# EAGLE design MMU8L (EAGLE 6.6.0)

## Sheet 1 of 2
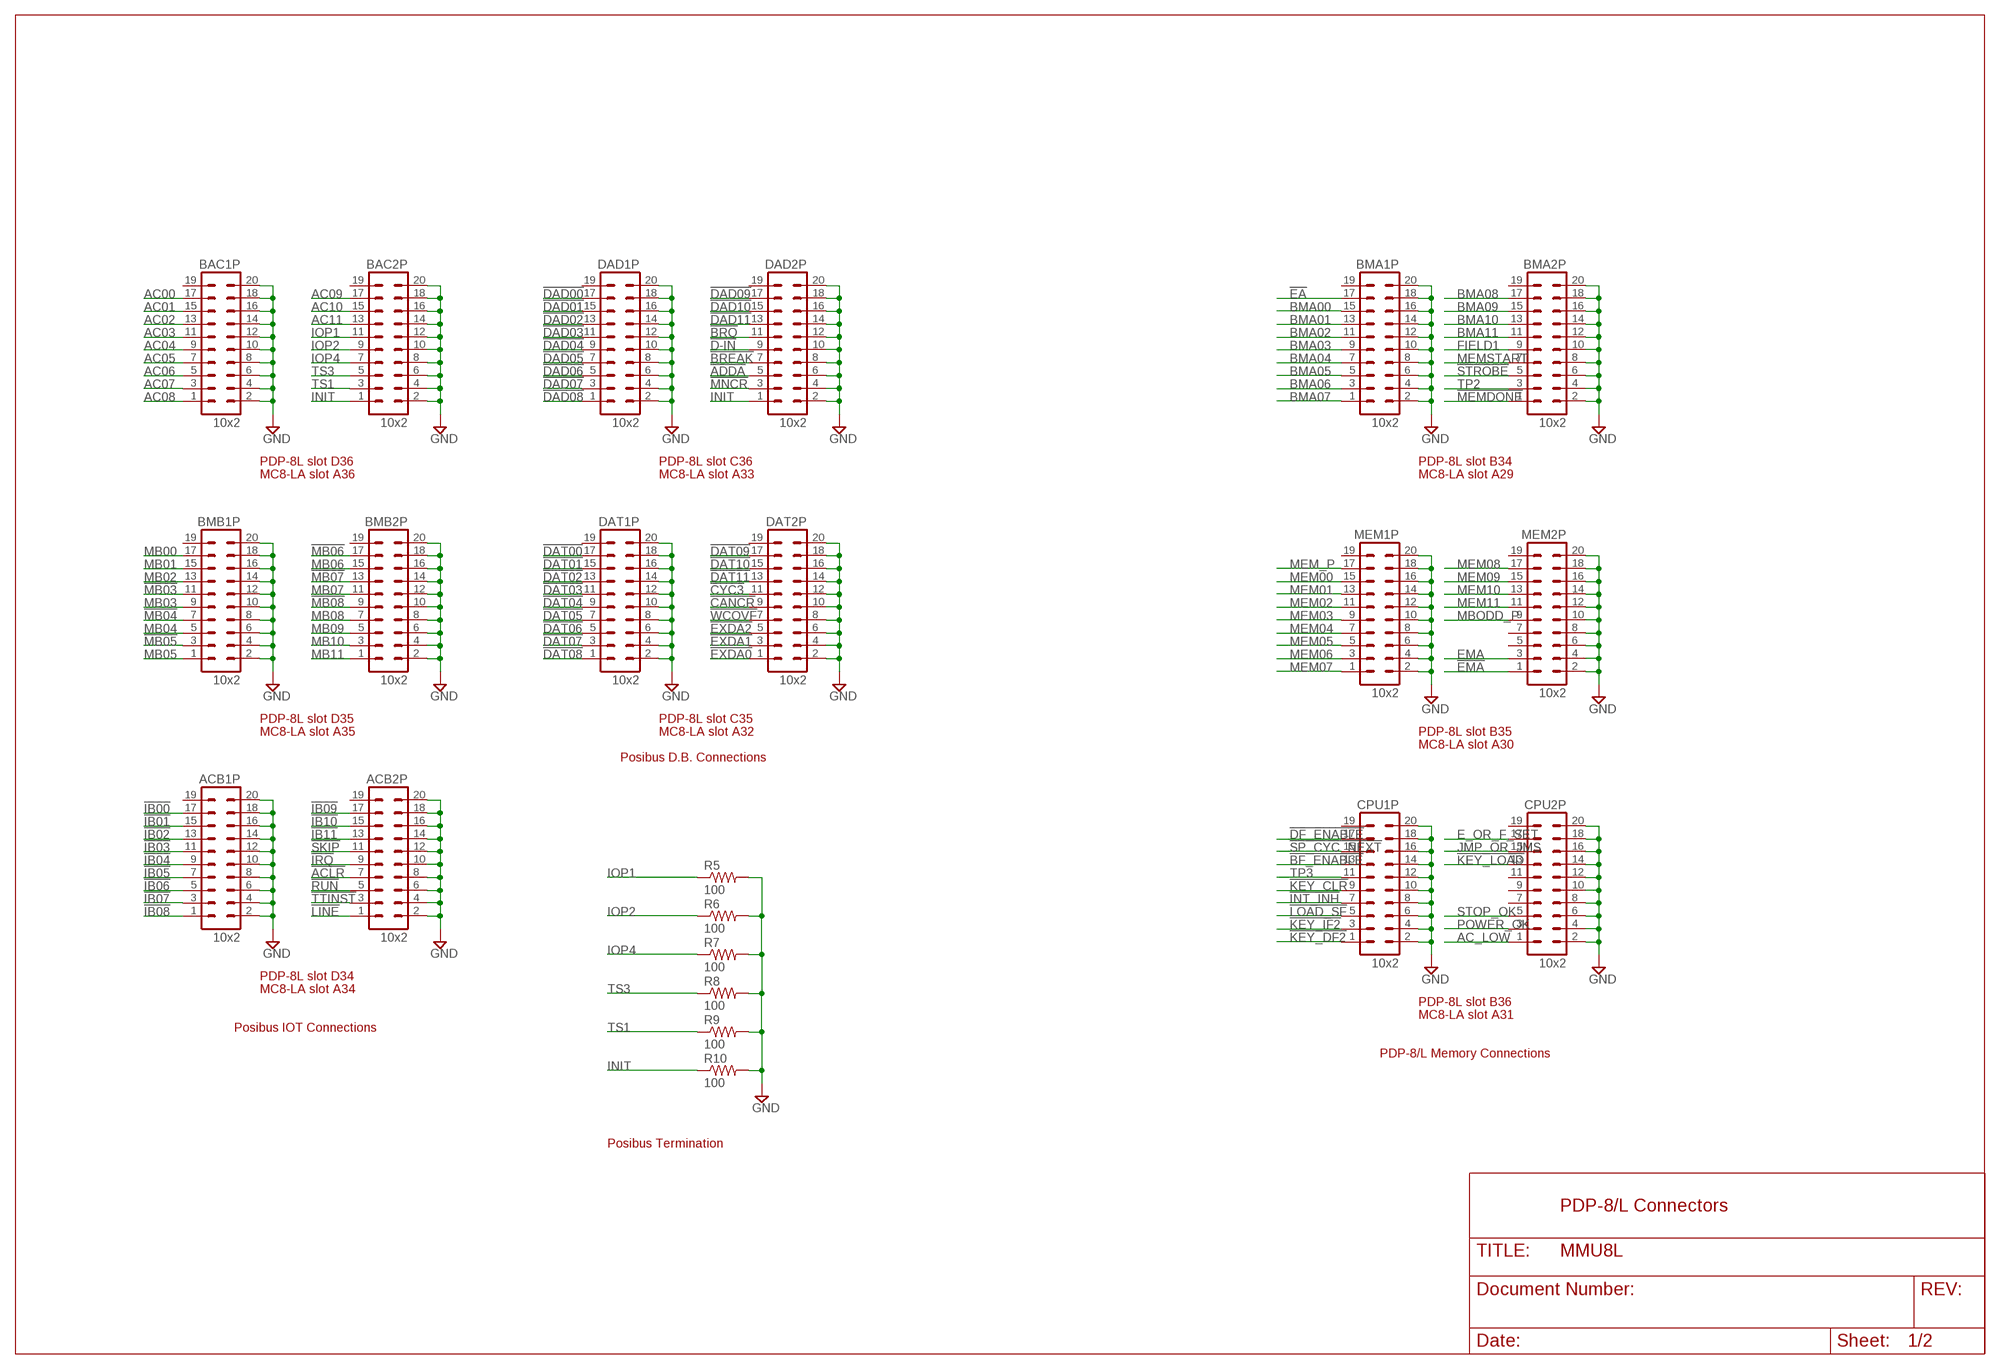
[diagram p0: schematic, sheet 1]

### Parts
ACB1P  10x2  MA10-2  [MA10-2]
ACB2P  10x2  MA10-2  [MA10-2]
BAC1P  10x2  MA10-2  [MA10-2]
BAC2P  10x2  MA10-2  [MA10-2]
BMA1P  10x2  MA10-2  [MA10-2]
BMA2P  10x2  MA10-2  [MA10-2]
BMB1P  10x2  MA10-2  [MA10-2]
BMB2P  10x2  MA10-2  [MA10-2]
CPU1P  10x2  MA10-2  [MA10-2]
CPU2P  10x2  MA10-2  [MA10-2]
DAD1P  10x2  MA10-2  [MA10-2]
DAD2P  10x2  MA10-2  [MA10-2]
DAT1P  10x2  MA10-2  [MA10-2]
DAT2P  10x2  MA10-2  [MA10-2]
MEM1P  10x2  MA10-2  [MA10-2]
MEM2P  10x2  MA10-2  [MA10-2]
R5  100  R-US_R1206  [R1206]
R6  100  R-US_R1206  [R1206]
R7  100  R-US_R1206  [R1206]
R8  100  R-US_R1206  [R1206]
R9  100  R-US_R1206  [R1206]
R10  100  R-US_R1206  [R1206]

### Nets
!ACLR: ACB2P.7 ; also sheet 2
!ADDA: DAD2P.5
!BF_ENABLE: CPU1P.13 ; also sheet 2
!BREAK: DAD2P.7
!BRQ: DAD2P.11
!CANCR: DAT2P.9
!CYC3: DAT2P.11
!D-IN: DAD2P.9
!DAD00: DAD1P.17
!DAD01: DAD1P.15
!DAD02: DAD1P.13
!DAD03: DAD1P.11
!DAD04: DAD1P.9
!DAD05: DAD1P.7
!DAD06: DAD1P.5
!DAD07: DAD1P.3
!DAD08: DAD1P.1
!DAD09: DAD2P.17
!DAD10: DAD2P.15
!DAD11: DAD2P.13
!DAT00: DAT1P.17
!DAT01: DAT1P.15
!DAT02: DAT1P.13
!DAT03: DAT1P.11
!DAT04: DAT1P.9
!DAT05: DAT1P.7
!DAT06: DAT1P.5
!DAT07: DAT1P.3
!DAT08: DAT1P.1
!DAT09: DAT2P.17
!DAT10: DAT2P.15
!DAT11: DAT2P.13
!DF_ENABLE: CPU1P.17 ; also sheet 2
!EA: BMA1P.17 ; also sheet 2
!EMA: MEM2P.1 ; also sheet 2
!EXDA0: DAT2P.1 ; also sheet 2
!EXDA1: DAT2P.3 ; also sheet 2
!EXDA2: DAT2P.5 ; also sheet 2
!IB00: ACB1P.17 ; also sheet 2
!IB01: ACB1P.15 ; also sheet 2
!IB02: ACB1P.13 ; also sheet 2
!IB03: ACB1P.11 ; also sheet 2
!IB04: ACB1P.9 ; also sheet 2
!IB05: ACB1P.7 ; also sheet 2
!IB06: ACB1P.5 ; also sheet 2
!IB07: ACB1P.3 ; also sheet 2
!IB08: ACB1P.1 ; also sheet 2
!IB09: ACB2P.17 ; also sheet 2
!IB10: ACB2P.15 ; also sheet 2
!IB11: ACB2P.13 ; also sheet 2
!INT_INH: CPU1P.7 ; also sheet 2
!IRQ: ACB2P.9 ; also sheet 2
!KEY_CLR: CPU1P.9 ; also sheet 2
!KEY_DF2: CPU1P.1 ; also sheet 2
!KEY_IF2: CPU1P.3 ; also sheet 2
!KEY_LOAD: CPU2P.13 ; also sheet 2
!LINE: ACB2P.1 ; also sheet 2
!LOAD_SF: CPU1P.5 ; also sheet 2
!MB03: BMB1P.11
!MB04: BMB1P.7
!MB05: BMB1P.3
!MB06: BMB2P.17
!MB07: BMB2P.13
!MB08: BMB2P.9
!MEMDONE: BMA2P.1 ; also sheet 2
!MNCR: DAD2P.3
!RUN: ACB2P.5 ; also sheet 2
!SKIP: ACB2P.11 ; also sheet 2
!SP_CYC_NEXT: CPU1P.15 ; also sheet 2
!STROBE: BMA2P.5 ; also sheet 2
!TTINST: ACB2P.3 ; also sheet 2
!WCOVF: DAT2P.7
AC00: BAC1P.17
AC01: BAC1P.15
AC02: BAC1P.13
AC03: BAC1P.11
AC04: BAC1P.9
AC05: BAC1P.7
AC06: BAC1P.5
AC07: BAC1P.3
AC08: BAC1P.1
AC09: BAC2P.17
AC10: BAC2P.15
AC11: BAC2P.13
AC_LOW: CPU2P.1 ; also sheet 2
BMA00: BMA1P.15 ; also sheet 2
BMA01: BMA1P.13 ; also sheet 2
BMA02: BMA1P.11 ; also sheet 2
BMA03: BMA1P.9 ; also sheet 2
BMA04: BMA1P.7 ; also sheet 2
BMA05: BMA1P.5 ; also sheet 2
BMA06: BMA1P.3 ; also sheet 2
BMA07: BMA1P.1 ; also sheet 2
BMA08: BMA2P.17 ; also sheet 2
BMA09: BMA2P.15 ; also sheet 2
BMA10: BMA2P.13 ; also sheet 2
BMA11: BMA2P.11 ; also sheet 2
E_OR_F_SET: CPU2P.17 ; also sheet 2
EMA: MEM2P.3 ; also sheet 2
FIELD1: BMA2P.9 ; also sheet 2
GND [supply]: ACB1P.2 ACB1P.4 ACB1P.6 ACB1P.8 ACB1P.10 ACB1P.12 ACB1P.14 ACB1P.16 ACB1P.18 ACB1P.20 ACB2P.2 ACB2P.4 ACB2P.6 ACB2P.8 ACB2P.10 ACB2P.12 ACB2P.14 ACB2P.16 ACB2P.18 ACB2P.20 BAC1P.2 BAC1P.4 BAC1P.6 BAC1P.8 BAC1P.10 BAC1P.12 BAC1P.14 BAC1P.16 BAC1P.18 BAC1P.20 BAC2P.2 BAC2P.4 BAC2P.6 BAC2P.8 BAC2P.10 BAC2P.12 BAC2P.14 BAC2P.16 BAC2P.18 BAC2P.20 BMA1P.2 BMA1P.4 BMA1P.6 BMA1P.8 BMA1P.10 BMA1P.12 BMA1P.14 BMA1P.16 BMA1P.18 BMA1P.20 BMA2P.2 BMA2P.4 BMA2P.6 BMA2P.8 BMA2P.10 BMA2P.12 BMA2P.14 BMA2P.16 BMA2P.18 BMA2P.20 BMB1P.2 BMB1P.4 BMB1P.6 BMB1P.8 BMB1P.10 BMB1P.12 BMB1P.14 BMB1P.16 BMB1P.18 BMB1P.20 BMB2P.2 BMB2P.4 BMB2P.6 BMB2P.8 BMB2P.10 BMB2P.12 BMB2P.14 BMB2P.16 BMB2P.18 BMB2P.20 CPU1P.2 CPU1P.4 CPU1P.6 CPU1P.8 CPU1P.10 CPU1P.12 CPU1P.14 CPU1P.16 CPU1P.18 CPU1P.20 CPU2P.2 CPU2P.4 CPU2P.6 CPU2P.8 CPU2P.10 CPU2P.12 CPU2P.14 CPU2P.16 CPU2P.18 CPU2P.20 DAD1P.2 DAD1P.4 DAD1P.6 DAD1P.8 DAD1P.10 DAD1P.12 DAD1P.14 DAD1P.16 DAD1P.18 DAD1P.20 DAD2P.2 DAD2P.4 DAD2P.6 DAD2P.8 DAD2P.10 DAD2P.12 DAD2P.14 DAD2P.16 DAD2P.18 DAD2P.20 DAT1P.2 DAT1P.4 DAT1P.6 DAT1P.8 DAT1P.10 DAT1P.12 DAT1P.14 DAT1P.16 DAT1P.18 DAT1P.20 DAT2P.2 DAT2P.4 DAT2P.6 DAT2P.8 DAT2P.10 DAT2P.12 DAT2P.14 DAT2P.16 DAT2P.18 DAT2P.20 MEM1P.2 MEM1P.4 MEM1P.6 MEM1P.8 MEM1P.10 MEM1P.12 MEM1P.14 MEM1P.16 MEM1P.18 MEM1P.20 MEM2P.2 MEM2P.4 MEM2P.6 MEM2P.8 MEM2P.10 MEM2P.12 MEM2P.14 MEM2P.16 MEM2P.18 MEM2P.20 R5.2 R6.2 R7.2 R8.2 R9.2 R10.2 ; also sheet 2
INIT: BAC2P.1 DAD2P.1 R10.1 ; also sheet 2
IOP1: BAC2P.11 R5.1 ; also sheet 2
IOP2: BAC2P.9 R6.1 ; also sheet 2
IOP4: BAC2P.7 R7.1 ; also sheet 2
JMP_OR_JMS: CPU2P.15 ; also sheet 2
MB00: BMB1P.17 ; also sheet 2
MB01: BMB1P.15 ; also sheet 2
MB02: BMB1P.13 ; also sheet 2
MB03: BMB1P.9 ; also sheet 2
MB04: BMB1P.5 ; also sheet 2
MB05: BMB1P.1 ; also sheet 2
MB06: BMB2P.15 ; also sheet 2
MB07: BMB2P.11 ; also sheet 2
MB08: BMB2P.7 ; also sheet 2
MB09: BMB2P.5 ; also sheet 2
MB10: BMB2P.3 ; also sheet 2
MB11: BMB2P.1 ; also sheet 2
MBODD_P: MEM2P.9 ; also sheet 2
MEM00: MEM1P.15 ; also sheet 2
MEM01: MEM1P.13 ; also sheet 2
MEM02: MEM1P.11 ; also sheet 2
MEM03: MEM1P.9 ; also sheet 2
MEM04: MEM1P.7 ; also sheet 2
MEM05: MEM1P.5 ; also sheet 2
MEM06: MEM1P.3 ; also sheet 2
MEM07: MEM1P.1 ; also sheet 2
MEM08: MEM2P.17 ; also sheet 2
MEM09: MEM2P.15 ; also sheet 2
MEM10: MEM2P.13 ; also sheet 2
MEM11: MEM2P.11 ; also sheet 2
MEM_P: MEM1P.17 ; also sheet 2
MEMSTART: BMA2P.7 ; also sheet 2
POWER_OK: CPU2P.3 ; also sheet 2
STOP_OK: CPU2P.5 ; also sheet 2
TP2: BMA2P.3 ; also sheet 2
TP3: CPU1P.11 ; also sheet 2
TS1: BAC2P.3 R9.1
TS3: BAC2P.5 R8.1
Unconnected: ACB1P.19 ACB2P.19 BAC1P.19 BAC2P.19 BMA1P.19 BMA2P.19 BMB1P.19 BMB2P.19 CPU1P.19 CPU2P.7 CPU2P.9 CPU2P.11 CPU2P.19 DAD1P.19 DAD2P.19 DAT1P.19 DAT2P.19 MEM1P.19 MEM2P.5 MEM2P.7 MEM2P.19

### Notes on the sheet
- PDP-8L slot D36 | PDP-8L slot C36 | PDP-8L slot B34
- MC8-LA slot A36 | MC8-LA slot A33 | MC8-LA slot A29
- PDP-8L slot D35 | PDP-8L slot C35
- MC8-LA slot A35 | MC8-LA slot A32 | PDP-8L slot B35
- MC8-LA slot A30
- Posibus D.B. Connections
- PDP-8L slot D34
- MC8-LA slot A34
- PDP-8L slot B36
- MC8-LA slot A31
- Posibus IOT Connections
- PDP-8/L Memory Connections
- Posibus Termination
- PDP-8/L Connectors

## Sheet 2 of 2
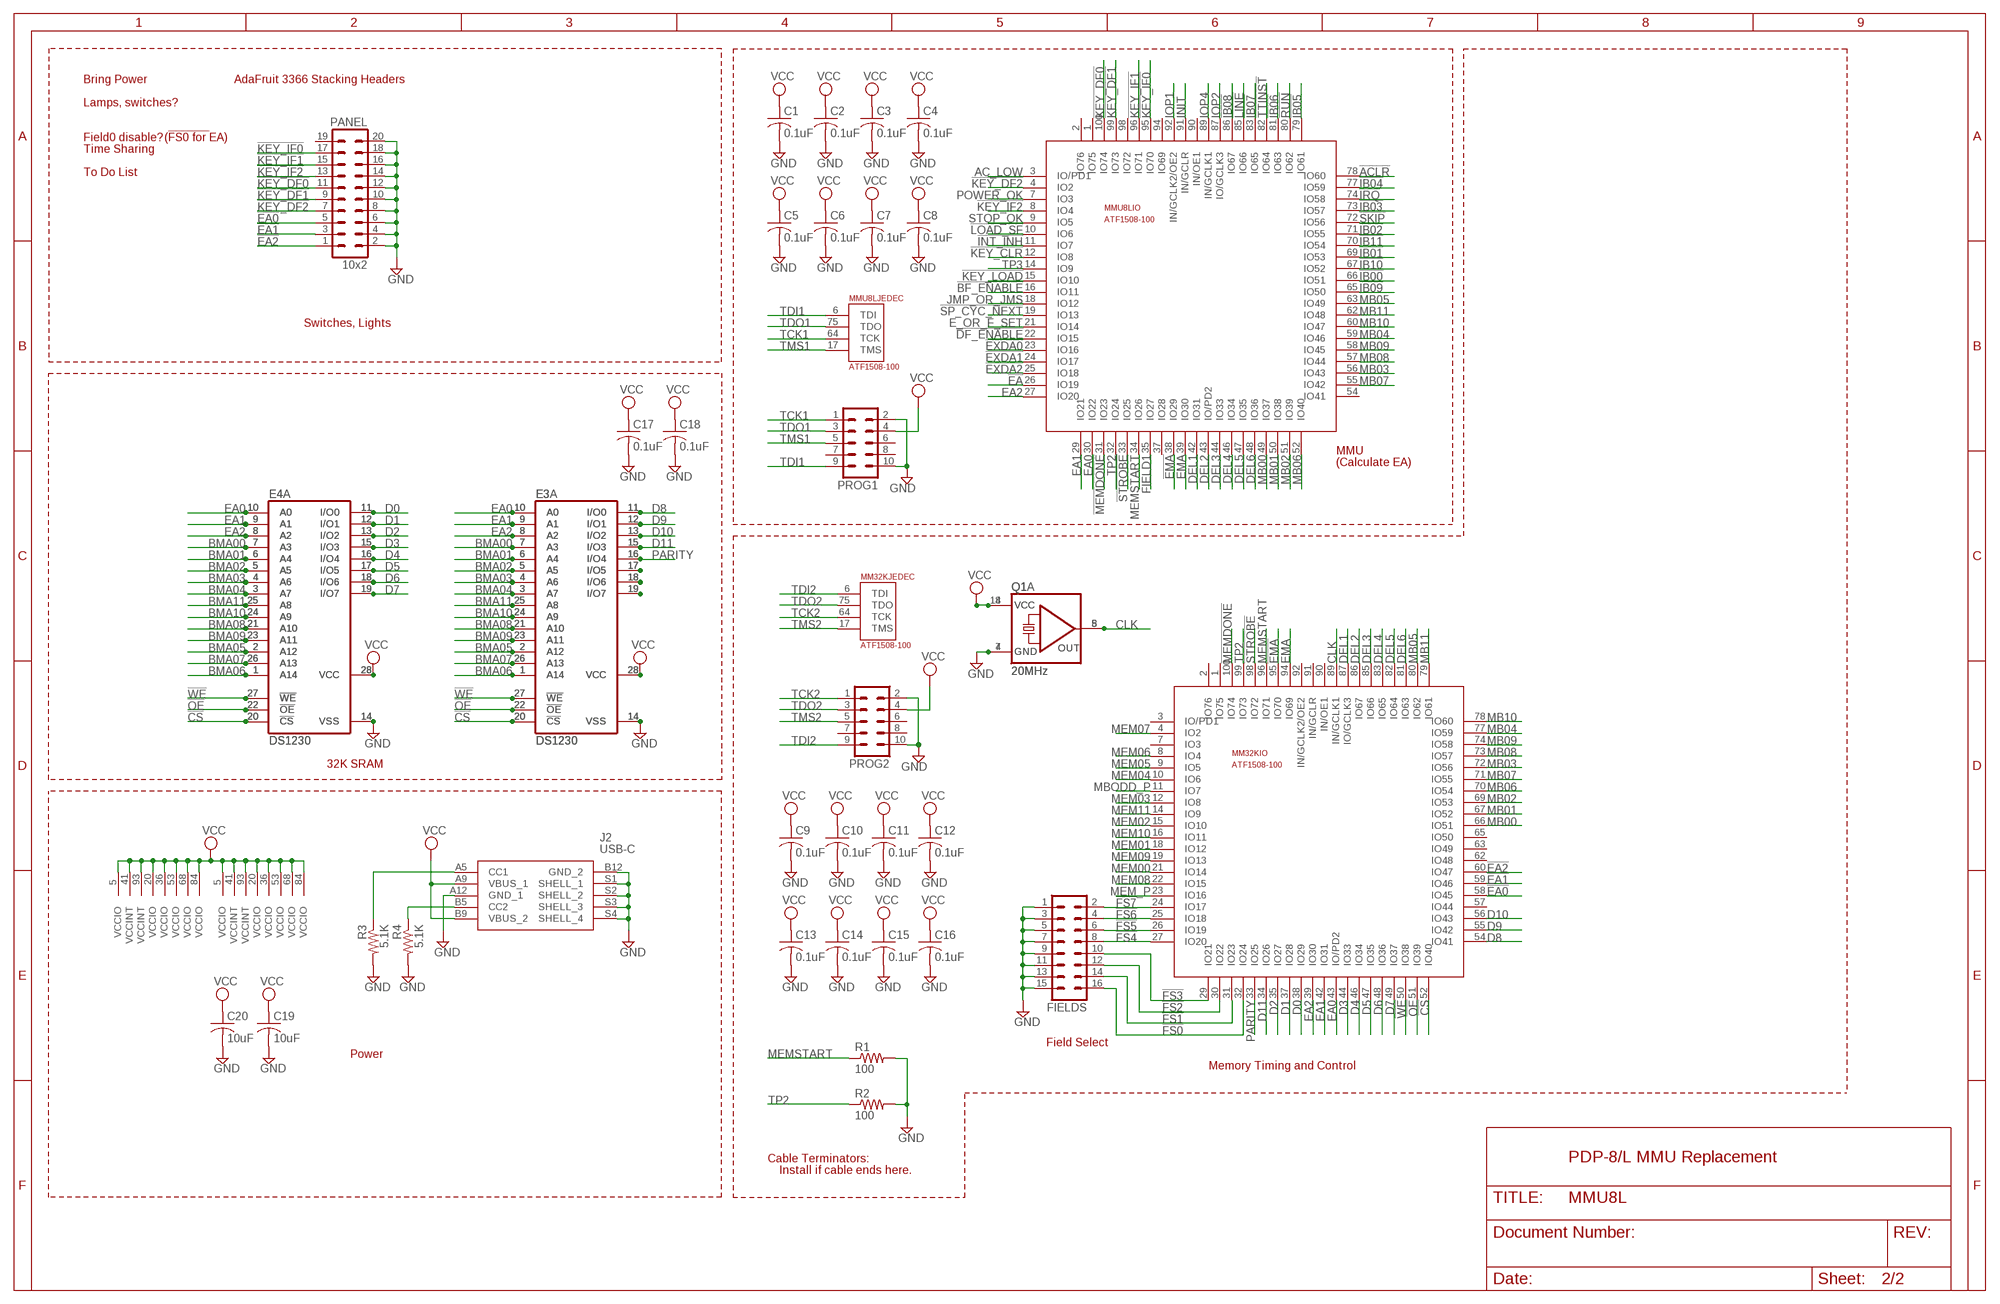
[diagram p1: schematic, sheet 2]

### Parts
C1  0.1uF  C-USC0805  [C0805]
C2  0.1uF  C-USC0805  [C0805]
C3  0.1uF  C-USC0805  [C0805]
C4  0.1uF  C-USC0805  [C0805]
C5  0.1uF  C-USC0805  [C0805]
C6  0.1uF  C-USC0805  [C0805]
C7  0.1uF  C-USC0805  [C0805]
C8  0.1uF  C-USC0805  [C0805]
C9  0.1uF  C-USC0805  [C0805]
C10  0.1uF  C-USC0805  [C0805]
C11  0.1uF  C-USC0805  [C0805]
C12  0.1uF  C-USC0805  [C0805]
C13  0.1uF  C-USC0805  [C0805]
C14  0.1uF  C-USC0805  [C0805]
C15  0.1uF  C-USC0805  [C0805]
C16  0.1uF  C-USC0805  [C0805]
C17  0.1uF  C-USC0805  [C0805]
C18  0.1uF  C-USC0805  [C0805]
C19  10uF  C-USC0805  [C0805]
C20  10uF  C-USC0805  [C0805]
E3  DS1230  62256P  [DIL28-6]
E3A  DS1230  62832P  [DIL28-3]
E4  DS1230  62256P  [DIL28-6]
E4A  DS1230  62832P  [DIL28-3]
FIELDS  MA08-2  [MA08-2]
J2  USB-C  USB4970-00-A  [USB497000A]
MM32K  ATF1508-100  ATF150X100PQFP  [PQFP-100]
MMU8L  ATF1508-100  ATF150X100PQFP  [PQFP-100]
PANEL  10x2  MA10-2  [MA10-2]
PROG1  ML10  [ML10]
PROG2  ML10  [ML10]
Q1  20MHz  QG5860  [DIL14S]
Q1A  20MHz  QG5460  [DIL08S]
R1  100  R-US_R1206  [R1206]
R2  100  R-US_R1206  [R1206]
R3  5.1K  R-US_R0805  [R0805]
R4  5.1K  R-US_R0805  [R0805]

### Nets
!ACLR: MMU8L.78(IO:IO60) ; also sheet 1
!BF_ENABLE: MMU8L.16(IO:IO11) ; also sheet 1
!CS: E3.20(!CS) E3A.20(!CS) E4.20(!CS) E4A.20(!CS) MM32K.52(IO:IO40)
!DF_ENABLE: MMU8L.22(IO:IO15) ; also sheet 1
!EA: MMU8L.26(IO:IO19) ; also sheet 1
!EA0: MM32K.58(IO:IO45) PANEL.5
!EA1: MM32K.59(IO:IO46) PANEL.3
!EA2: MM32K.60(IO:IO47) PANEL.1
!EMA: MM32K.95(IO:IO70) MMU8L.38(IO:IO29) ; also sheet 1
!EXDA0: MMU8L.23(IO:IO16) ; also sheet 1
!EXDA1: MMU8L.24(IO:IO17) ; also sheet 1
!EXDA2: MMU8L.25(IO:IO18) ; also sheet 1
!FS0: FIELDS.16 MM32K.32(IO:IO24)
!FS1: FIELDS.14 MM32K.31(IO:IO23)
!FS2: FIELDS.12 MM32K.30(IO:IO22)
!FS3: FIELDS.10 MM32K.29(IO:IO21)
!FS4: FIELDS.8 MM32K.27(IO:IO20)
!FS5: FIELDS.6 MM32K.26(IO:IO19)
!FS6: FIELDS.4 MM32K.25(IO:IO18)
!FS7: FIELDS.2 MM32K.24(IO:IO17)
!IB00: MMU8L.66(IO:IO51) ; also sheet 1
!IB01: MMU8L.69(IO:IO53) ; also sheet 1
!IB02: MMU8L.71(IO:IO55) ; also sheet 1
!IB03: MMU8L.73(IO:IO57) ; also sheet 1
!IB04: MMU8L.77(IO:IO59) ; also sheet 1
!IB05: MMU8L.79(IO:IO61) ; also sheet 1
!IB06: MMU8L.81(IO:IO63) ; also sheet 1
!IB07: MMU8L.83(IO:IO65) ; also sheet 1
!IB08: MMU8L.86(IO:IO67) ; also sheet 1
!IB09: MMU8L.65(IO:IO50) ; also sheet 1
!IB10: MMU8L.67(IO:IO52) ; also sheet 1
!IB11: MMU8L.70(IO:IO54) ; also sheet 1
!INT_INH: MMU8L.11(IO:IO7) ; also sheet 1
!IRQ: MMU8L.74(IO:IO58) ; also sheet 1
!KEY_CLR: MMU8L.12(IO:IO8) ; also sheet 1
!KEY_DF0: MMU8L.100(IO:IO74) PANEL.11
!KEY_DF1: MMU8L.99(IO:IO73) PANEL.9
!KEY_DF2: MMU8L.4(IO:IO2) PANEL.7 ; also sheet 1
!KEY_IF0: MMU8L.95(IO:IO70) PANEL.17
!KEY_IF1: MMU8L.96(IO:IO71) PANEL.15
!KEY_IF2: MMU8L.8(IO:IO4) PANEL.13 ; also sheet 1
!KEY_LOAD: MMU8L.15(IO:IO10) ; also sheet 1
!LINE: MMU8L.85(IO:IO66) ; also sheet 1
!LOAD_SF: MMU8L.10(IO:IO6) ; also sheet 1
!MEMDONE: MM32K.100(IO:IO74) MMU8L.31(IO:IO23) ; also sheet 1
!OE: E3.22(!OE) E3A.22(!OE) E4.22(!OE) E4A.22(!OE) MM32K.51(IO:IO39)
!RUN: MMU8L.80(IO:IO62) ; also sheet 1
!SKIP: MMU8L.72(IO:IO56) ; also sheet 1
!SP_CYC_NEXT: MMU8L.19(IO:IO13) ; also sheet 1
!STROBE: MM32K.98(IO:IO72) MMU8L.33(IO:IO25) ; also sheet 1
!TTINST: MMU8L.82(IO:IO64) ; also sheet 1
!WE: E3.27(!WE) E3A.27(!WE) E4.27(!WE) E4A.27(!WE) MM32K.50(IO:IO38)
AC_LOW: MMU8L.3(IO:IO/PD1) ; also sheet 1
BMA00: E3.7(A3) E3A.7(A3) E4.7(A3) E4A.7(A3) ; also sheet 1
BMA01: E3.6(A4) E3A.6(A4) E4.6(A4) E4A.6(A4) ; also sheet 1
BMA02: E3.5(A5) E3A.5(A5) E4.5(A5) E4A.5(A5) ; also sheet 1
BMA03: E3.4(A6) E3A.4(A6) E4.4(A6) E4A.4(A6) ; also sheet 1
BMA04: E3.3(A7) E3A.3(A7) E4.3(A7) E4A.3(A7) ; also sheet 1
BMA05: E3.2(A12) E3A.2(A12) E4.2(A12) E4A.2(A12) ; also sheet 1
BMA06: E3.1(A14) E3A.1(A14) E4.1(A14) E4A.1(A14) ; also sheet 1
BMA07: E3.26(A13) E3A.26(A13) E4.26(A13) E4A.26(A13) ; also sheet 1
BMA08: E3.21(A10) E3A.21(A10) E4.21(A10) E4A.21(A10) ; also sheet 1
BMA09: E3.23(A11) E3A.23(A11) E4.23(A11) E4A.23(A11) ; also sheet 1
BMA10: E3.24(A9) E3A.24(A9) E4.24(A9) E4A.24(A9) ; also sheet 1
BMA11: E3.25(A8) E3A.25(A8) E4.25(A8) E4A.25(A8) ; also sheet 1
CLK: MM32K.89(IO:IN/GCLK1) Q1.8(OUT) Q1A.5(OUT)
D0: E4.11(I/O0) E4A.11(I/O0) MM32K.38(IO:IO29)
D1: E4.12(I/O1) E4A.12(I/O1) MM32K.37(IO:IO28)
D2: E4.13(I/O2) E4A.13(I/O2) MM32K.35(IO:IO27)
D3: E4.15(I/O3) E4A.15(I/O3) MM32K.44(IO:IO33)
D4: E4.16(I/O4) E4A.16(I/O4) MM32K.46(IO:IO34)
D5: E4.17(I/O5) E4A.17(I/O5) MM32K.47(IO:IO35)
D6: E4.18(I/O6) E4A.18(I/O6) MM32K.48(IO:IO36)
D7: E4.19(I/O7) E4A.19(I/O7) MM32K.49(IO:IO37)
D8: E3.11(I/O0) E3A.11(I/O0) MM32K.54(IO:IO41)
D9: E3.12(I/O1) E3A.12(I/O1) MM32K.55(IO:IO42)
D10: E3.13(I/O2) E3A.13(I/O2) MM32K.56(IO:IO43)
D11: E3.15(I/O3) E3A.15(I/O3) MM32K.34(IO:IO26)
DEL1: MM32K.87(IO:IO/GCLK3) MMU8L.42(IO:IO31)
DEL2: MM32K.86(IO:IO67) MMU8L.43(IO:IO/PD2)
DEL3: MM32K.85(IO:IO66) MMU8L.44(IO:IO33)
DEL4: MM32K.83(IO:IO65) MMU8L.46(IO:IO34)
DEL5: MM32K.82(IO:IO64) MMU8L.47(IO:IO35)
DEL6: MM32K.81(IO:IO63) MMU8L.48(IO:IO36)
E_OR_F_SET: MMU8L.21(IO:IO14) ; also sheet 1
EA0: E3.10(A0) E3A.10(A0) E4.10(A0) E4A.10(A0) MM32K.43(IO:IO/PD2) MMU8L.30(IO:IO22)
EA1: E3.9(A1) E3A.9(A1) E4.9(A1) E4A.9(A1) MM32K.42(IO:IO31) MMU8L.29(IO:IO21)
EA2: E3.8(A2) E3A.8(A2) E4.8(A2) E4A.8(A2) MM32K.39(IO:IO30) MMU8L.27(IO:IO20)
EMA: MM32K.94(IO:IO69) MMU8L.39(IO:IO30) ; also sheet 1
FIELD1: MMU8L.35(IO:IO27) ; also sheet 1
GND [supply]: C1.2 C2.2 C3.2 C4.2 C5.2 C6.2 C7.2 C8.2 C9.2 C10.2 C11.2 C12.2 C13.2 C14.2 C15.2 C16.2 C17.2 C18.2 C19.2 C20.2 E3.14(VSS) E3A.14(VSS) E4.14(VSS) E4A.14(VSS) FIELDS.1 FIELDS.3 FIELDS.5 FIELDS.7 FIELDS.9 FIELDS.11 FIELDS.13 FIELDS.15 J2.A12(GND_1) J2.B12(GND_2) J2.S1(SHELL_1) J2.S2(SHELL_2) J2.S3(SHELL_3) J2.S4(SHELL_4) PANEL.2 PANEL.4 PANEL.6 PANEL.8 PANEL.10 PANEL.12 PANEL.14 PANEL.16 PANEL.18 PANEL.20 PROG1.2 PROG1.10 PROG2.2 PROG2.10 Q1.7(GND) Q1A.4(GND) R1.2 R2.2 R3.2 R4.2 ; also sheet 1
INIT: MMU8L.91(IO:IN/GCLR) ; also sheet 1
IOP1: MMU8L.92(IO:IN/GCLK2/OE2) ; also sheet 1
IOP2: MMU8L.87(IO:IO/GCLK3) ; also sheet 1
IOP4: MMU8L.89(IO:IN/GCLK1) ; also sheet 1
JMP_OR_JMS: MMU8L.18(IO:IO12) ; also sheet 1
MB00: MM32K.66(IO:IO51) MMU8L.49(IO:IO37) ; also sheet 1
MB01: MM32K.67(IO:IO52) MMU8L.50(IO:IO38) ; also sheet 1
MB02: MM32K.69(IO:IO53) MMU8L.51(IO:IO39) ; also sheet 1
MB03: MM32K.72(IO:IO56) MMU8L.56(IO:IO43) ; also sheet 1
MB04: MM32K.77(IO:IO59) MMU8L.59(IO:IO46) ; also sheet 1
MB05: MM32K.80(IO:IO62) MMU8L.63(IO:IO49) ; also sheet 1
MB06: MM32K.70(IO:IO54) MMU8L.52(IO:IO40) ; also sheet 1
MB07: MM32K.71(IO:IO55) MMU8L.55(IO:IO42) ; also sheet 1
MB08: MM32K.73(IO:IO57) MMU8L.57(IO:IO44) ; also sheet 1
MB09: MM32K.74(IO:IO58) MMU8L.58(IO:IO45) ; also sheet 1
MB10: MM32K.78(IO:IO60) MMU8L.60(IO:IO47) ; also sheet 1
MB11: MM32K.79(IO:IO61) MMU8L.62(IO:IO48) ; also sheet 1
MBODD_P: MM32K.11(IO:IO7) ; also sheet 1
MEM00: MM32K.21(IO:IO14) ; also sheet 1
MEM01: MM32K.18(IO:IO12) ; also sheet 1
MEM02: MM32K.15(IO:IO10) ; also sheet 1
MEM03: MM32K.12(IO:IO8) ; also sheet 1
MEM04: MM32K.10(IO:IO6) ; also sheet 1
MEM05: MM32K.9(IO:IO5) ; also sheet 1
MEM06: MM32K.8(IO:IO4) ; also sheet 1
MEM07: MM32K.4(IO:IO2) ; also sheet 1
MEM08: MM32K.22(IO:IO15) ; also sheet 1
MEM09: MM32K.19(IO:IO13) ; also sheet 1
MEM10: MM32K.16(IO:IO11) ; also sheet 1
MEM11: MM32K.14(IO:IO9) ; also sheet 1
MEM_P: MM32K.23(IO:IO16) ; also sheet 1
MEMSTART: MM32K.96(IO:IO71) MMU8L.34(IO:IO26) R1.1 ; also sheet 1
N$1: J2.B5(CC2) R4.1
N$2: E3.17(I/O5) E3A.17(I/O5)
N$3: E3.18(I/O6) E3A.18(I/O6)
N$4: E3.19(I/O7) E3A.19(I/O7)
N$5: J2.A5(CC1) R3.1
PARITY: E3.16(I/O4) E3A.16(I/O4) MM32K.33(IO:IO25)
POWER_OK: MMU8L.7(IO:IO3) ; also sheet 1
STOP_OK: MMU8L.9(IO:IO5) ; also sheet 1
TCK1: MMU8L.64(JEDEC:TCK) PROG1.1
TCK2: MM32K.64(JEDEC:TCK) PROG2.1
TDI1: MMU8L.6(JEDEC:TDI) PROG1.9
TDI2: MM32K.6(JEDEC:TDI) PROG2.9
TDO1: MMU8L.75(JEDEC:TDO) PROG1.3
TDO2: MM32K.75(JEDEC:TDO) PROG2.3
TMS1: MMU8L.17(JEDEC:TMS) PROG1.5
TMS2: MM32K.17(JEDEC:TMS) PROG2.5
TP2: MM32K.99(IO:IO73) MMU8L.32(IO:IO24) R2.1 ; also sheet 1
TP3: MMU8L.14(IO:IO9) ; also sheet 1
VCC [supply]: C1.1 C2.1 C3.1 C4.1 C5.1 C6.1 C7.1 C8.1 C9.1 C10.1 C11.1 C12.1 C13.1 C14.1 C15.1 C16.1 C17.1 C18.1 C19.1 C20.1 E3.28(VCC) E3A.28(VCC) E4.28(VCC) E4A.28(VCC) J2.A9(VBUS_1) J2.B9(VBUS_2) MM32K.5(VCCIO) MM32K.20(VCCIO) MM32K.36(VCCIO) MM32K.41(VCCINT) MM32K.53(VCCIO) MM32K.68(VCCIO) MM32K.84(VCCIO) MM32K.93(VCCINT) MMU8L.5(VCCIO) MMU8L.20(VCCIO) MMU8L.36(VCCIO) MMU8L.41(VCCINT) MMU8L.53(VCCIO) MMU8L.68(VCCIO) MMU8L.84(VCCIO) MMU8L.93(VCCINT) PROG1.4 PROG2.4 Q1.14(VCC) Q1A.8(VCC)
Unconnected: MM32K.1(IO:IO75) MM32K.2(IO:IO76) MM32K.3(IO:IO/PD1) MM32K.7(IO:IO3) MM32K.57(IO:IO44) MM32K.62(IO:IO48) MM32K.63(IO:IO49) MM32K.65(IO:IO50) MM32K.90(IO:IN/OE1) MM32K.91(IO:IN/GCLR) MM32K.92(IO:IN/GCLK2/OE2) MMU8L.1(IO:IO75) MMU8L.2(IO:IO76) MMU8L.37(IO:IO28) MMU8L.54(IO:IO41) MMU8L.90(IO:IN/OE1) MMU8L.94(IO:IO69) MMU8L.98(IO:IO72) PANEL.19 PROG1.6 PROG1.7 PROG1.8 PROG2.6 PROG2.7 PROG2.8

### Notes on the sheet
- Bring Power | AdaFruit 3366 Stacking Headers
- Lamps, switches?
- Field0 disable? | (!FS0 for !EA)
- Time Sharing
- To Do List
- Switches, Lights
- MMU
- (Calculate EA)
- 32K SRAM
- Field Select
- Power
- Memory Timing and Control
- Cable Terminators: | PDP-8/L MMU Replacement
- Install if cable ends here.

## Power pins joined to a net without a drawn wire
GND: MM32K.13(GND) MM32K.28(GND) MM32K.40(GND) MM32K.45(GND) MM32K.61(GND) MM32K.76(GND) MM32K.88(GND) MM32K.97(GND) MMU8L.13(GND) MMU8L.28(GND) MMU8L.40(GND) MMU8L.45(GND) MMU8L.61(GND) MMU8L.76(GND) MMU8L.88(GND) MMU8L.97(GND)

## Library data of the parts
ACB1P ACB2P BAC1P BAC2P BMA1P BMA2P BMB1P BMB2P CPU1P CPU2P DAD1P DAD2P DAT1P DAT2P MEM1P MEM2P PANEL = con-lstb:MA10-2: PIN HEADER; OC_FARNELL: unknown; OC_NEWARK: unknown
C1-C20 = rcl:C-US: CAPACITOR, American symbol
E3 E4 = memory-hitachi:62256P: MEMORY; OC_FARNELL: unknown; OC_NEWARK: unknown
E3A E4A = memory-hitachi:62832P: MEMORY; OC_FARNELL: unknown; OC_NEWARK: unknown
FIELDS = con-lstb:MA08-2: PIN HEADER; OC_FARNELL: unknown; OC_NEWARK: unknown
J2 = USB4970-00-A:USB4970-00-A: USB-C (USB TYPE-C) Receptacle Connector 24 (6+18 Dummy) Position Surface Mount, Right Angle; Through Hole Source: Datasheet <3dcadmodel>; DESCRIPTION: USB-C (USB TYPE-C) Receptacle Connector 24 (6+18 Dummy) Position Surface Mount, Right Angle; Through Hole; HEIGHT: 3.41mm; MANUFACTURER_NAME: GCT (GLOBAL CONNECTOR TECHNOLOGY); MANUFACTURER_PART_NUMBER: USB4970-00-A
MM32K MMU8L = atmel-cpld:ATF150X100: ATF150x in 100 pin package.
PROG1 PROG2 = con-harting-ml:ML10: HARTING; OC_FARNELL: unknown; OC_NEWARK: unknown
Q1 = crystal:QG5860: CRYSTAL RESONATOR; OC_FARNELL: unknown; OC_NEWARK: unknown
Q1A = crystal:QG5460: CRYSTAL RESONATOR; OC_FARNELL: unknown; OC_NEWARK: unknown
R1-R10 = rcl:R-US_: RESISTOR, American symbol

## Net classes
0 default: width 0.406 mm
1 supply: width 0.406 mm

## Board
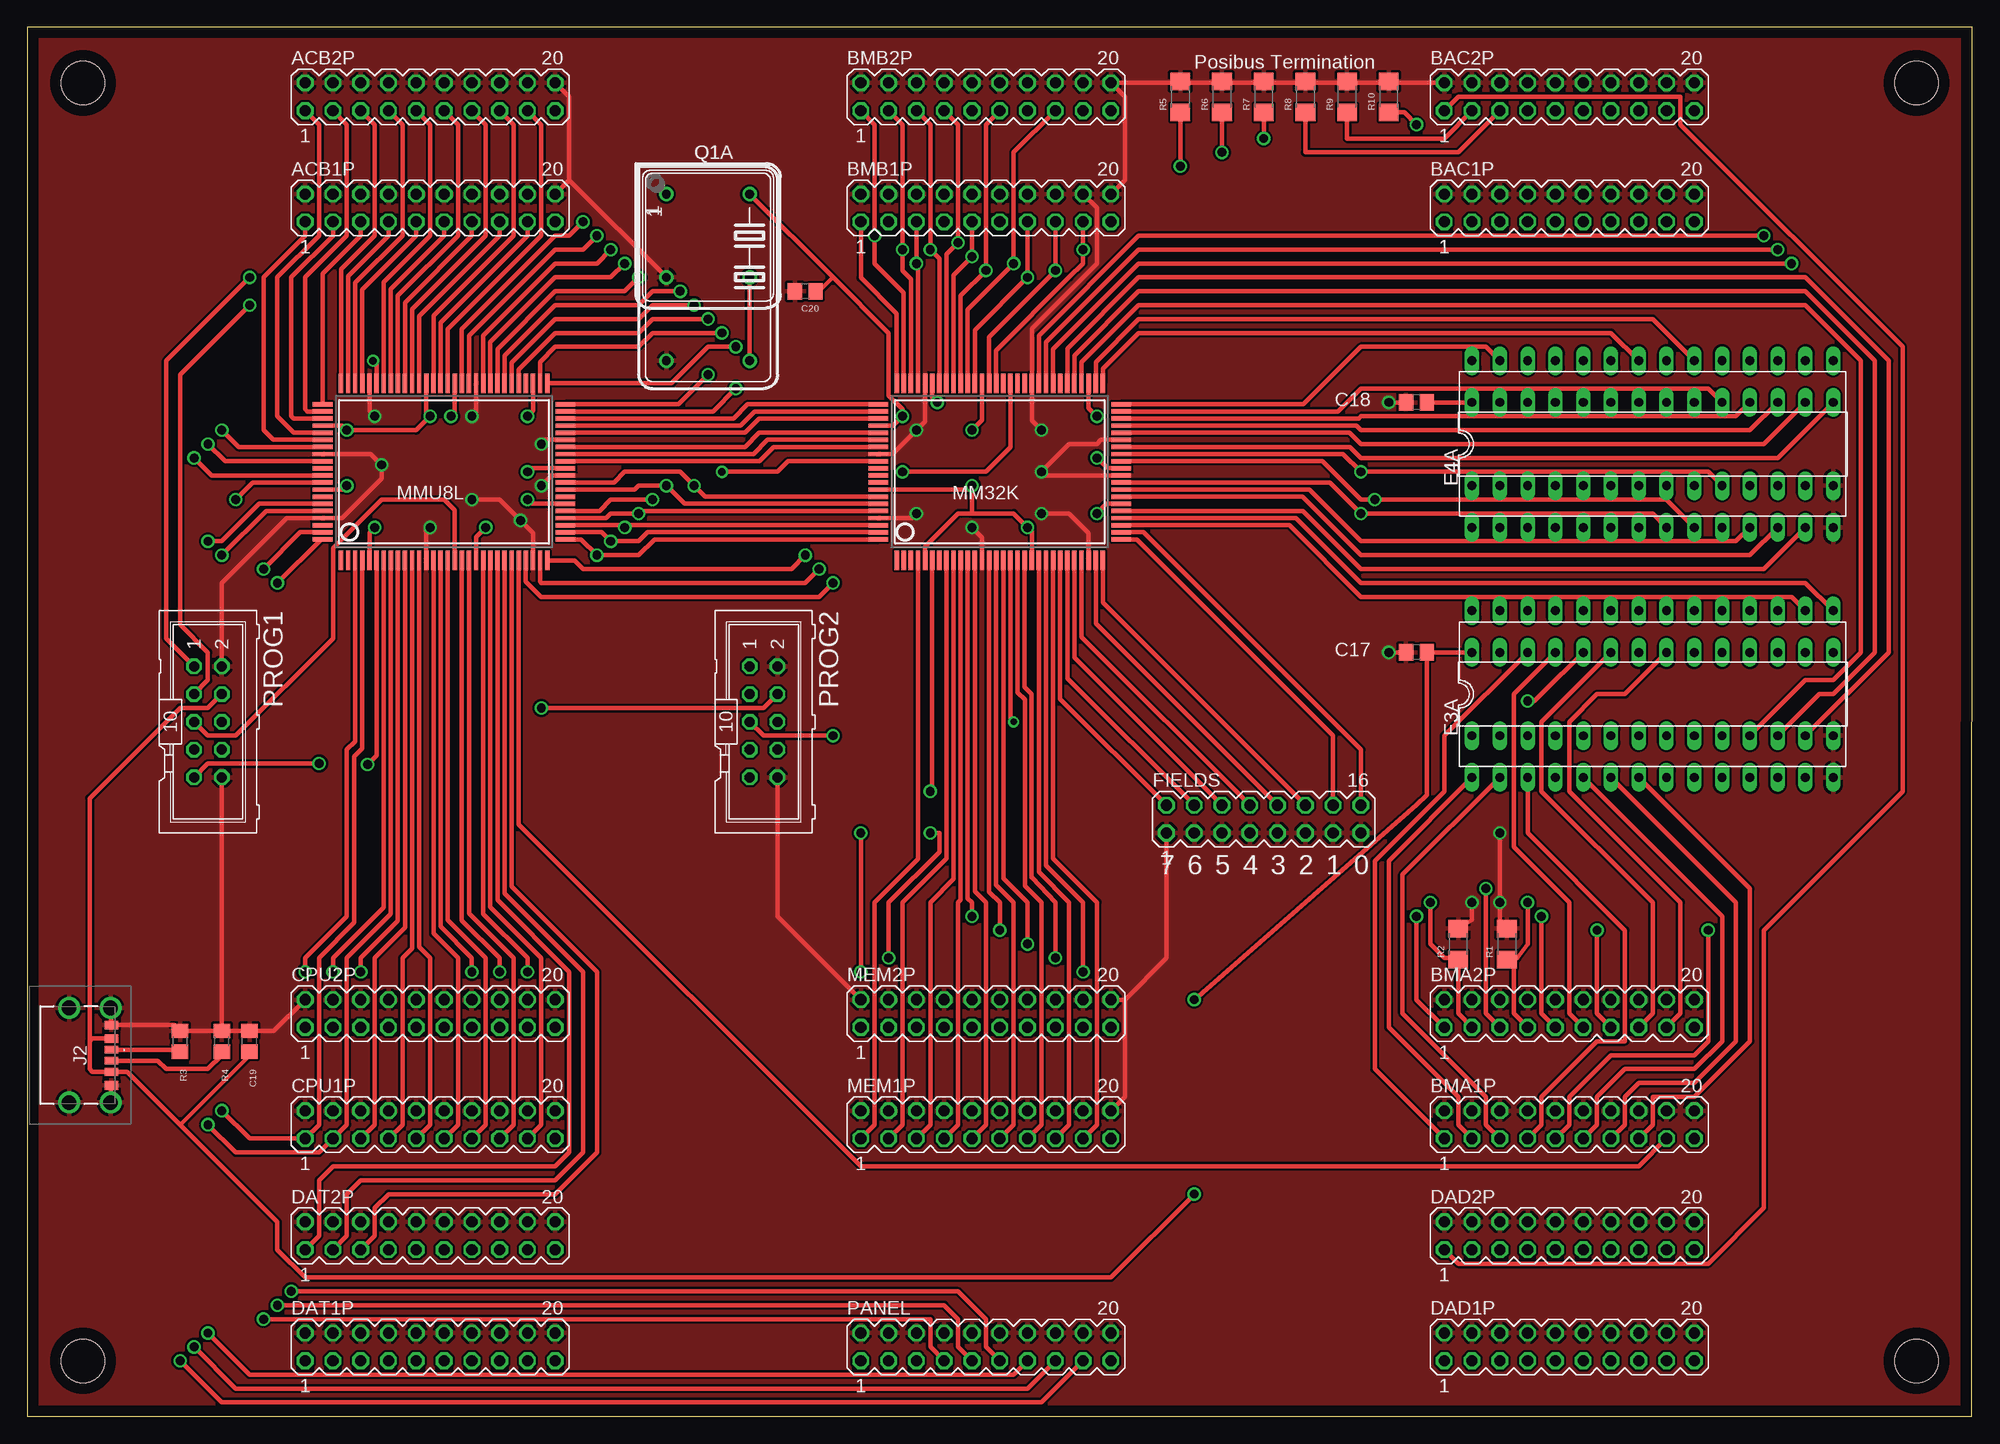
[diagram p2: board, top side]
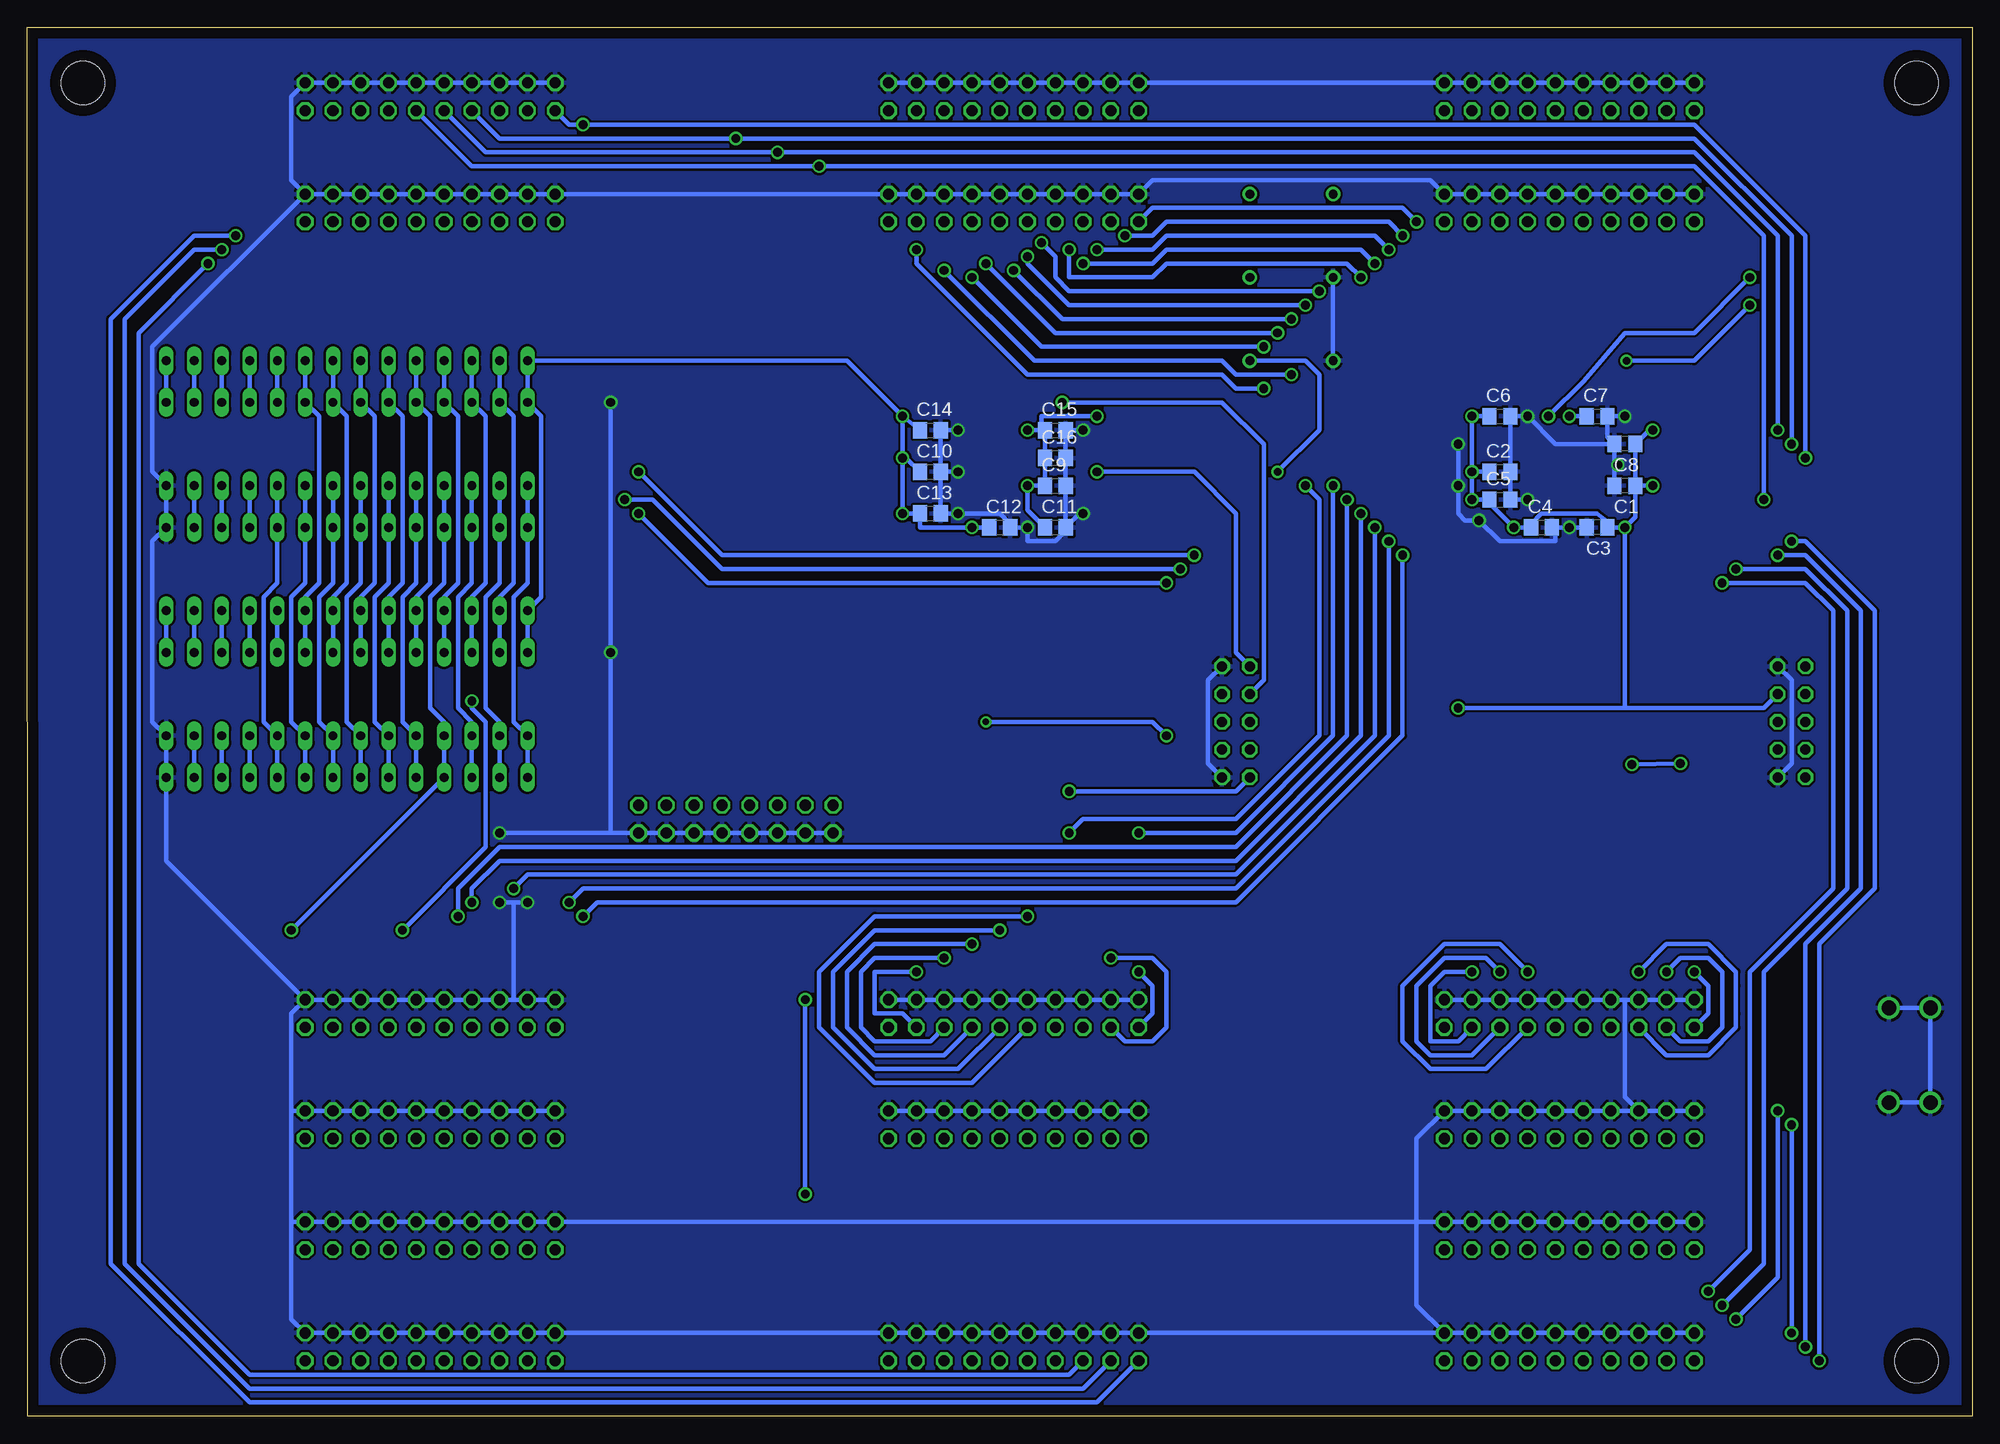
[diagram p3: board, bottom side, seen from below]

Size 177.8 x 127 mm. Coordinates in mm from the lower left corner, seen from the top.
Outline: 0,0 177.78,0 177.8,127 0,127 0,0
Copper layers (1*16): Top 0.035mm / dielectric 1.5mm / Bottom 0.035mm
Design rules "default *": minimum track width 10mil, minimum drill 24mil, track to track 8mil, track to pad 8mil, pad to pad 8mil, via to via 8mil, smd to smd 8mil, copper to edge 40mil, drill to drill 8mil, minimum pad ring 10mil, minimum via ring 8mil, stop-mask expansion 4mil, vias tented up to drill 0mil, thermal gap 10mil
Holes 3.97 mm at 5.08,121.92 172.72,121.92 172.72,5.08 5.08,5.08

### Footprints (pad centres in the part's own frame; a part is rotated, then mirrored left to right if it is on the bottom)
MA10-2 = drill 1.016 octagon: 1 -11.43,-1.27; 2 -11.43,1.27; 3 -8.89,-1.27; 4 -8.89,1.27; 5 -6.35,-1.27; 6 -6.35,1.27; 7 -3.81,-1.27; 8 -3.81,1.27; 9 -1.27,-1.27; 10 -1.27,1.27; 11 1.27,-1.27; 12 1.27,1.27; 13 3.81,-1.27; 14 3.81,1.27; 15 6.35,-1.27; 16 6.35,1.27; 17 8.89,-1.27; 18 8.89,1.27; 19 11.43,-1.27; 20 11.43,1.27
C0805 = smd 1.3 x 1.5: 1 -0.95,0; 2 0.95,0
DIL28-6 = drill 0.813 long: 1 -16.51,-7.62; 2 -13.97,-7.62; 3 -11.43,-7.62; 4 -8.89,-7.62; 5 -6.35,-7.62; 6 -3.81,-7.62; 7 -1.27,-7.62; 8 1.27,-7.62; 9 3.81,-7.62; 10 6.35,-7.62; 11 8.89,-7.62; 12 11.43,-7.62; 13 13.97,-7.62; 14 16.51,-7.62; 15 16.51,7.62; 16 13.97,7.62; 17 11.43,7.62; 18 8.89,7.62; 19 6.35,7.62; 20 3.81,7.62; 21 1.27,7.62; 22 -1.27,7.62; 23 -3.81,7.62; 24 -6.35,7.62; 25 -8.89,7.62; 26 -11.43,7.62; 27 -13.97,7.62; 28 -16.51,7.62
DIL28-3 = drill 0.813 long: 1 -16.51,-3.81; 2 -13.97,-3.81; 3 -11.43,-3.81; 4 -8.89,-3.81; 5 -6.35,-3.81; 6 -3.81,-3.81; 7 -1.27,-3.81; 8 1.27,-3.81; 9 3.81,-3.81; 10 6.35,-3.81; 11 8.89,-3.81; 12 11.43,-3.81; 13 13.97,-3.81; 14 16.51,-3.81; 15 16.51,3.81; 16 13.97,3.81; 17 11.43,3.81; 18 8.89,3.81; 19 6.35,3.81; 20 3.81,3.81; 21 1.27,3.81; 22 -1.27,3.81; 23 -3.81,3.81; 24 -6.35,3.81; 25 -8.89,3.81; 26 -11.43,3.81; 27 -13.97,3.81; 28 -16.51,3.81
MA08-2 = drill 1.016 octagon: 1 -8.89,-1.27; 2 -8.89,1.27; 3 -6.35,-1.27; 4 -6.35,1.27; 5 -3.81,-1.27; 6 -3.81,1.27; 7 -1.27,-1.27; 8 -1.27,1.27; 9 1.27,-1.27; 10 1.27,1.27; 11 3.81,-1.27; 12 3.81,1.27; 13 6.35,-1.27; 14 6.35,1.27; 15 8.89,-1.27; 16 8.89,1.27
USB497000A = smd 0.7 x 1.2: A5 -0.5,3.88; B5 0.5,3.88 | smd 0.76 x 1.2: A9 1.52,3.88; B9 -1.52,3.88 | smd 0.8 x 1.2: A12 2.75,3.88; B12 -2.75,3.88 | drill 1.34 pad 1.7: S1 -4.32,3.8; S2 4.32,3.8 | drill 1.34 pad 2.01: S3 -4.32,0; S4 4.32,0
PQFP-100 = smd 0.4 x 1.8: 1 -9.425,-8.1; 2 -8.775,-8.1; 3 -8.125,-8.1; 4 -7.475,-8.1; 5 -6.825,-8.1; 6 -6.175,-8.1; 7 -5.525,-8.1; 8 -4.875,-8.1; 9 -4.225,-8.1; 10 -3.575,-8.1; 11 -2.925,-8.1; 12 -2.275,-8.1; 13 -1.625,-8.1; 14 -0.975,-8.1; 15 -0.325,-8.1; 16 0.325,-8.1; 17 0.975,-8.1; 18 1.625,-8.1; 19 2.275,-8.1; 20 2.925,-8.1; 21 3.575,-8.1; 22 4.225,-8.1; 23 4.875,-8.1; 24 5.525,-8.1; 25 6.175,-8.1; 26 6.825,-8.1; 27 7.475,-8.1; 28 8.125,-8.1; 29 8.775,-8.1; 30 9.425,-8.1; 51 9.425,8.1; 52 8.775,8.1; 53 8.125,8.1; 54 7.475,8.1; 55 6.825,8.1; 56 6.175,8.1; 57 5.525,8.1; 58 4.875,8.1; 59 4.225,8.1; 60 3.575,8.1; 61 2.925,8.1; 62 2.275,8.1; 63 1.625,8.1; 64 0.975,8.1; 65 0.325,8.1; 66 -0.325,8.1; 67 -0.975,8.1; 68 -1.625,8.1; 69 -2.275,8.1; 70 -2.925,8.1; 71 -3.575,8.1; 72 -4.225,8.1; 73 -4.875,8.1; 74 -5.525,8.1; 75 -6.175,8.1; 76 -6.825,8.1; 77 -7.475,8.1; 78 -8.125,8.1; 79 -8.775,8.1; 80 -9.425,8.1 | smd 1.8 x 0.4: 31 11.1,-6.175; 32 11.1,-5.525; 33 11.1,-4.875; 34 11.1,-4.225; 35 11.1,-3.575; 36 11.1,-2.925; 37 11.1,-2.275; 38 11.1,-1.625; 39 11.1,-0.975; 40 11.1,-0.325; 41 11.1,0.325; 42 11.1,0.975; 43 11.1,1.625; 44 11.1,2.275; 45 11.1,2.925; 46 11.1,3.575; 47 11.1,4.225; 48 11.1,4.875; 49 11.1,5.525; 50 11.1,6.175; 81 -11.1,6.175; 82 -11.1,5.525; 83 -11.1,4.875; 84 -11.1,4.225; 85 -11.1,3.575; 86 -11.1,2.925; 87 -11.1,2.275; 88 -11.1,1.625; 89 -11.1,0.975; 90 -11.1,0.325; 91 -11.1,-0.325; 92 -11.1,-0.975; 93 -11.1,-1.625; 94 -11.1,-2.275; 95 -11.1,-2.925; 96 -11.1,-3.575; 97 -11.1,-4.225; 98 -11.1,-4.875; 99 -11.1,-5.525; 100 -11.1,-6.175
ML10 = drill 0.914 octagon: 1 -5.08,-1.27; 2 -5.08,1.27; 3 -2.54,-1.27; 4 -2.54,1.27; 5 0,-1.27; 6 0,1.27; 7 2.54,-1.27; 8 2.54,1.27; 9 5.08,-1.27; 10 5.08,1.27
DIL14S = drill 0.813: 1 -7.62,-3.81; 7 7.62,-3.81; 8 7.62,3.81; 14 -7.62,3.81
DIL08S = drill 0.813: 1 -3.81,-3.81; 4 3.81,-3.81; 5 3.81,3.81; 8 -3.81,3.81
R1206 = smd 1.6 x 1.803: 1 -1.422,0; 2 1.422,0
R0805 = smd 1.3 x 1.5: 1 -0.95,0; 2 0.95,0

### Placement (x,y rotation side)
ACB1P  36.83,110.49 0 top
ACB2P  36.83,120.65 0 top
BAC1P  140.97,110.49 0 top
BAC2P  140.97,120.65 0 top
BMA1P  140.97,26.67 0 top
BMA2P  140.97,36.83 0 top
BMB1P  87.63,110.49 0 top
BMB2P  87.63,120.65 0 top
C1  31.75,85.09 180 bottom
C2  43.18,86.36 0 bottom
C3  34.29,81.28 180 bottom
C4  39.37,81.28 0 bottom
C5  43.18,83.82 0 bottom
C6  43.18,91.44 0 bottom
C7  34.29,91.44 0 bottom
C8  31.75,88.9 180 bottom
C9  83.82,85.09 0 bottom
C10  95.25,86.36 0 bottom
C11  83.82,81.28 0 bottom
C12  88.9,81.28 0 bottom
C13  95.25,82.55 0 bottom
C14  95.25,90.17 0 bottom
C15  83.82,90.17 0 bottom
C16  83.82,87.63 0 bottom
C17  127,69.85 180 top
C18  127,92.71 180 top
C19  20.32,34.29 90 top
C20  71.12,102.87 180 top
CPU1P  36.83,26.67 0 top
CPU2P  36.83,36.83 0 top
DAD1P  140.97,6.35 0 top
DAD2P  140.97,16.51 0 top
DAT1P  36.83,6.35 0 top
DAT2P  36.83,16.51 0 top
E3  148.59,66.04 0 top
E3A  148.59,66.04 0 top
E4  148.59,88.9 0 top
E4A  148.59,88.9 0 top
FIELDS  113.03,54.61 0 top
J2  3.81,33.02 270 top
MEM1P  87.63,26.67 0 top
MEM2P  87.63,36.83 0 top
MM32K  88.9,86.36 0 top
MMU8L  38.1,86.36 0 top
PANEL  87.63,6.35 0 top
PROG1  16.51,63.5 270 top
PROG2  67.31,63.5 270 top
Q1  62.23,104.14 270 top
Q1A  62.23,107.95 270 top
R1  135.25,43.18 90 top
R2  130.81,43.18 90 top
R3  13.97,34.29 90 top
R4  17.78,34.29 90 top
R5  105.41,120.65 90 top
R6  109.22,120.65 90 top
R7  113.03,120.65 90 top
R8  116.84,120.65 90 top
R9  120.65,120.65 90 top
R10  124.46,120.65 90 top

### Tracks (layer width: path | path; a pad name or v marks a point on that pad's centre or on a via)
!ACLR
  Top 0.406: ACB2P.7 34.29,118.11 34.29,107.95 29.98,103.64 MMU8L.78
!BF_ENABLE
  Top 0.406: CPU1P.13 41.91,26.67 41.91,41.91 38.42,45.4 MMU8L.16
!CS
  Top 0.406: E4.20 148.59,100.33 101.6,100.33 97.67,96.41 MM32K.52
  Bottom 0.406: E4.20 E4A.20 151.13,91.44 151.13,76.2 152.4,74.93 E3.20 E3A.20
!DF_ENABLE
  Top 0.406: CPU1P.17 46.99,26.67 46.99,41.91 42.33,46.58 MMU8L.22
!EA
  Top 0.406: BMA1P.17 147.32,22.86 76.2,22.86 44.92,54.13 MMU8L.26
!EA0  (via drill 0.81)
  Top 0.406: v161.29,105.41 101.6,105.41 93.78,97.58 MM32K.58
  Bottom 0.406: PANEL.5 82.55,3.81 157.48,3.81 167.64,13.97 167.64,99.06 v161.29,105.41
!EA1  (via drill 0.81)
  Top 0.406: MM32K.59 93.12,97.79 93.12,98.2 101.6,106.68 v160.02,106.68
  Bottom 0.406: PANEL.3 81.28,2.54 157.48,2.54 168.91,13.97 168.91,100.33 162.56,106.68 v160.02,106.68
!EA2  (via drill 0.81)
  Top 0.406: v158.75,107.95 101.6,107.95 92.47,98.83 MM32K.60
  Bottom 0.406: PANEL.1 80.01,1.27 157.48,1.27 170.18,13.97 170.18,100.33 162.56,107.95 v158.75,107.95
!EMA  (via drill 0.81)
  Top 0.406: v76.2,40.64 v76.2,53.34 | MMU8L.38 55.52,84.73 55.88,85.09 v58.42,85.09 60.08,83.44 MM32K.95
  Bottom 0.406: MEM2P.1 74.93,36.83 74.93,39.37 v76.2,40.64 | v76.2,53.34 67.31,53.34 58.42,62.23 v58.42,85.09
!EXDA0
  Top 0.406: DAT2P.1 26.67,16.51 26.67,21.59 27.94,22.86 48.26,22.86 49.53,24.13 49.53,40.64 42.98,47.2 MMU8L.23
!EXDA1
  Top 0.406: DAT2P.3 29.21,16.51 29.21,20.32 30.48,21.59 48.26,21.59 50.8,24.13 50.8,40.64 43.62,47.81 MMU8L.24
!EXDA2
  Top 0.406: DAT2P.5 31.75,16.51 31.75,19.05 33.02,20.32 48.26,20.32 52.07,24.13 52.07,40.64 44.27,48.44 MMU8L.25
!FS0
  Top 0.406: FIELDS.16 121.92,60.96 102.05,80.83 MM32K.32
!FS1
  Top 0.406: FIELDS.14 119.38,62.23 101.42,80.19 MM32K.31
!FS2
  Top 0.406: FIELDS.12 98.33,74.39 MM32K.30
!FS3
  Top 0.406: FIELDS.10 97.67,72.5 MM32K.29
!FS4
  Top 0.406: FIELDS.8 96.38,71.27 MM32K.27
!FS5
  Top 0.406: FIELDS.6 95.72,69.38 MM32K.26
!FS6
  Top 0.406: FIELDS.4 95.08,67.48 MM32K.25
!FS7
  Top 0.406: FIELDS.2 94.42,65.59 MM32K.24
!IB00
  Top 0.406: ACB1P.17 45.72,107.95 37.77,100 MMU8L.66
!IB01
  Top 0.406: ACB1P.15 43.18,107.95 35.83,100.59 MMU8L.69
!IB02
  Top 0.406: ACB1P.13 40.64,107.95 34.52,101.83 MMU8L.71
!IB03
  Top 0.406: ACB1P.11 38.1,107.95 33.23,103.08 MMU8L.73
!IB04
  Top 0.406: ACB1P.9 35.56,107.95 30.62,103.02 MMU8L.77
!IB05
  Top 0.406: ACB1P.7 33.02,107.95 29.32,104.25 MMU8L.79
!IB06
  Top 0.406: ACB1P.5 30.48,107.95 27,104.47 MMU8L.81
!IB07
  Top 0.406: ACB1P.3 27.94,107.95 24.13,104.14 24.13,91.44 24.34,91.23 MMU8L.83
!IB08
  Top 0.406: ACB1P.1 25.4,107.95 21.59,104.14 21.59,90.17 22.48,89.28 MMU8L.86
!IB09
  Top 0.406: ACB2P.17 46.99,118.11 46.99,107.95 38.42,99.39 MMU8L.65
!IB10
  Top 0.406: ACB2P.15 44.45,118.11 44.45,107.95 37.12,100.62 MMU8L.67
!IB11
  Top 0.406: ACB2P.13 41.91,118.11 41.91,107.95 35.17,101.22 MMU8L.70
!INT_INH
  Top 0.406: CPU1P.7 34.29,26.67 34.29,41.91 35.17,42.8 MMU8L.11
!IRQ
  Top 0.406: ACB2P.9 36.83,118.11 36.83,107.95 32.58,103.69 MMU8L.74
!KEY_CLR
  Top 0.406: CPU1P.9 36.83,26.67 36.83,41.91 35.83,42.91 MMU8L.12
!KEY_DF0  (via drill 0.81)
  Top 0.406: PANEL.11 87.63,6.35 87.63,8.89 85.09,11.43 v24.13,11.43 | v22.86,76.2 26.84,80.19 MMU8L.100
  Bottom 0.406: v24.13,11.43 20.32,15.24 20.32,40.64 12.7,48.26 12.7,73.66 15.24,76.2 v22.86,76.2
!KEY_DF1  (via drill 0.81)
  Top 0.406: PANEL.9 85.09,6.35 85.09,8.89 83.82,10.16 v22.86,10.16 | v21.59,77.47 24.95,80.83 MMU8L.99
  Bottom 0.406: v22.86,10.16 19.05,13.97 19.05,40.64 11.43,48.26 11.43,73.66 15.24,77.47 v21.59,77.47
!KEY_DF2  (via drill 0.81)
  Top 0.406: MMU8L.4 30.62,61.06 29.9,60.34 29.9,45.14 26.67,41.91 26.67,26.67 CPU1P.1 20.32,25.4 v17.78,27.94 | PANEL.7 82.55,6.35 82.55,8.89 v21.59,8.89
  Bottom 0.406: v21.59,8.89 17.78,12.7 v17.78,27.94
!KEY_IF0  (via drill 0.81)
  Top 0.406: PANEL.17 92.71,1.27 17.78,1.27 v13.97,5.08 | v16.51,80.01 17.78,80.01 21.2,83.44 MMU8L.95
  Bottom 0.406: v13.97,5.08 13.97,43.18 8.89,48.26 8.89,73.66 15.24,80.01 v16.51,80.01
!KEY_IF1  (via drill 0.81)
  Top 0.406: PANEL.15 91.44,2.54 19.05,2.54 v15.24,6.35 | v17.78,78.74 21.82,82.78 MMU8L.96
  Bottom 0.406: v15.24,6.35 15.24,43.18 10.16,48.26 10.16,73.66 15.24,78.74 v17.78,78.74
!KEY_IF2  (via drill 0.81)
  Top 0.406: MMU8L.8 33.23,45.92 29.21,41.91 29.21,26.67 CPU1P.3 26.67,24.13 19.05,24.13 v16.51,26.67 | PANEL.13 90.17,3.81 20.32,3.81 v16.51,7.62
  Bottom 0.406: v16.51,7.62 v16.51,26.67
!KEY_LOAD  (via drill 0.81)
  Top 0.406: v40.64,40.64 40.64,41.91 37.77,44.77 MMU8L.15
  Bottom 0.406: CPU2P.13 44.45,31.75 49.53,31.75 52.07,34.29 52.07,39.37 48.26,43.18 43.18,43.18 v40.64,40.64
!LINE
  Top 0.406: ACB2P.1 26.67,118.11 26.67,107.95 22.86,104.14 22.86,91.44 24.36,89.94 MMU8L.85
!LOAD_SF
  Top 0.406: CPU1P.5 31.75,26.67 31.75,41.91 34.52,44.69 MMU8L.10
!MEMDONE  (via drill 0.81)
  Top 0.406: BMA2P.1 127,38.1 v127,45.72 | MMU8L.31 50.62,80.19 v52.07,78.74 55.88,78.74 57.33,80.19 MM32K.100
  Bottom 0.406: v127,45.72 125.73,46.99 67.31,46.99 52.07,62.23 v52.07,78.74
!OE
  Top 0.406: E4.22 144.78,99.06 101.6,99.06 98.33,95.78 MM32K.51
  Bottom 0.406: E4.22 E4A.22 146.05,91.44 146.05,76.2 147.32,74.93 E3.22 E3A.22
!RUN
  Top 0.406: ACB2P.5 31.75,118.11 31.75,107.95 28.68,104.88 MMU8L.80
!SKIP
  Top 0.406: ACB2P.11 39.37,118.11 39.37,107.95 33.88,102.45 MMU8L.72
!SP_CYC_NEXT
  Top 0.406: CPU1P.15 44.45,26.67 44.45,41.91 40.38,45.98 MMU8L.19
!STROBE  (via drill 0.81)
  Top 0.406: BMA2P.5 133.35,36.83 v133.35,48.26 | MMU8L.33 54.41,81.48 v54.61,81.28 54.81,81.48 MM32K.98
  Bottom 0.406: v133.35,48.26 132.08,49.53 67.31,49.53 54.61,62.23 v54.61,81.28
!TTINST
  Top 0.406: ACB2P.3 29.21,118.11 29.21,107.95 25.4,104.14 25.4,92.08 25.59,91.89 MMU8L.82
!WE
  Top 0.406: E4.27 133.35,97.79 121.92,97.79 116.67,92.53 MM32K.50
  Bottom 0.406: E4.27 E4A.27 133.35,91.44 133.35,76.2 134.62,74.93 E3.27 E3A.27
AC_LOW  (via drill 0.81)
  Top 0.406: v25.4,40.64 25.4,41.91 29.21,45.72 29.21,60.96 29.98,61.73 MMU8L.3
  Bottom 0.406: CPU2P.1 24.13,36.83 24.13,39.37 v25.4,40.64
BMA00
  Top 0.406: BMA1P.15 148.59,26.67 148.59,29.21 152.4,29.21 157.48,34.29 157.48,48.26 E3.7
  Bottom 0.406: E4A.7 E4.7 147.32,76.2 148.59,74.93 148.59,63.5 E3A.7 E3.7
BMA01
  Top 0.406: BMA1P.13 146.05,26.67 146.05,29.21 147.32,30.48 152.4,30.48 156.21,34.29 156.21,46.99 E3.6
  Bottom 0.406: E4A.6 E4.6 144.78,76.2 146.05,74.93 146.05,63.5 E3A.6 E3.6
BMA02
  Top 0.406: BMA1P.11 143.51,26.67 143.51,29.21 146.05,31.75 152.4,31.75 154.94,34.29 154.94,45.72 E3.5
  Bottom 0.406: E4A.5 E4.5 142.24,76.2 143.51,74.93 143.51,63.5 E3A.5 E3.5
BMA03  (via drill 0.81)
  Top 0.406: BMA1P.9 140.97,26.67 140.97,29.21 144.78,33.02 152.4,33.02 153.67,34.29 v153.67,44.45
  Bottom 0.406: E4A.4 E4.4 139.7,76.2 140.97,74.93 140.97,64.77 139.7,63.5 E3A.4 E3.4 v153.67,44.45
BMA04
  Top 0.406: BMA1P.7 138.43,26.67 138.43,29.21 143.51,34.29 146.05,34.29 146.05,44.45 137.16,53.34 E3.3
  Bottom 0.406: E4A.3 E4.3 137.16,76.2 138.43,74.93 138.43,64.77 137.16,63.5 E3A.3 E3.3
BMA05
  Top 0.406: BMA1P.5 133.35,26.67 133.35,29.21 125.73,36.83 125.73,49.53 E3.2
  Bottom 0.406: E3.2 E3A.2 134.62,63.5 135.89,64.77 135.89,74.93 134.62,76.2 E4.2 E4A.2
BMA06
  Top 0.406: BMA1P.3 130.81,26.67 130.81,29.21 124.46,35.56 124.46,50.8 E3.1
  Bottom 0.406: E3.1 E3A.1 133.35,63.5 133.35,74.93 132.08,76.2 E4.1 E4A.1
BMA07
  Top 0.406: BMA1P.1 123.19,31.75 123.19,50.8 129.54,57.15 129.54,62.23 E3A.26
  Bottom 0.406: E3A.26 E3.26 137.16,74.93 135.89,76.2 135.89,91.44 E4A.26 E4.26
BMA08
  Top 0.406: BMA2P.17 151.13,36.83 151.13,46.99 140.97,57.15 140.97,63.5 143.51,66.04 146.05,66.04 E3A.21
  Bottom 0.406: E3A.21 E3.21 149.86,74.93 148.59,76.2 148.59,91.44 E4A.21 E4.21
BMA09
  Top 0.406: BMA2P.15 148.59,36.83 148.59,46.99 138.43,57.15 138.43,63.5 E3A.23
  Bottom 0.406: E4.23 E4A.23 143.51,91.44 143.51,76.2 144.78,74.93 E3.23 E3A.23
BMA10  (via drill 0.81)
  Top 0.406: BMA2P.13 143.51,36.83 v143.51,44.45 | v137.16,65.41 137.79,65.41 138.43,66.04 E3A.24
  Bottom 0.406: E4.24 E4A.24 140.97,91.44 140.97,76.2 142.24,74.93 E3.24 E3A.24 | v143.51,44.45 135.89,52.07 135.89,63.5 137.16,64.77 v137.16,65.41
BMA11
  Top 0.406: BMA2P.11 140.97,36.83 140.97,46.99 135.89,52.07 135.89,66.04 E3A.25
  Bottom 0.406: E4.25 E4A.25 138.43,91.44 138.43,76.2 139.7,74.93 E3.25 E3A.25
CLK  (via drill 0.7)
  Top 0.406: Q1.8 Q1A.5 | v63.5,86.36 68.58,86.36 69.56,87.33 MM32K.89
  Bottom 0.406: Q1.8 60.96,96.52 59.69,95.25 59.69,90.17 v63.5,86.36
D0
  Top 0.406: E4.11 156.21,80.01 121.92,80.01 117.19,84.73 MM32K.38
  Bottom 0.406: E4A.11 E4.11
D1
  Top 0.406: E4.12 157.48,78.74 121.92,78.74 116.58,84.08 MM32K.37
  Bottom 0.406: E4A.12 E4.12
D2
  Top 0.406: E4.13 158.75,77.47 121.92,77.47 116.61,82.78 MM32K.35
  Bottom 0.406: E4A.13 E4.13
D3
  Top 0.406: E4A.15 160.02,87.63 121.92,87.63 120.92,88.64 MM32K.44
  Bottom 0.406: E4.15 E4A.15
D4
  Top 0.406: E4A.16 158.75,88.9 121.92,88.9 120.89,89.94 MM32K.46
  Bottom 0.406: E4.16 E4A.16
D5
  Top 0.406: E4A.17 157.48,90.17 121.92,90.17 121.5,90.58 MM32K.47
  Bottom 0.406: E4.17 E4A.17
D6
  Top 0.406: E4A.18 156.21,91.44 121.92,91.44 121.72,91.23 MM32K.48
  Bottom 0.406: E4.18 E4A.18
D7
  Top 0.406: E4A.19 153.67,93.98 121.92,93.98 119.83,91.89 MM32K.49
  Bottom 0.406: E4.19 E4A.19
D8
  Top 0.406: E3A.11 162.56,67.31 165.1,67.31 167.64,69.85 167.64,96.52 162.56,101.6 101.6,101.6 96.38,96.38 MM32K.54
  Bottom 0.406: E3.11 E3A.11
D9
  Top 0.406: E3A.12 163.83,66.04 165.1,66.04 168.91,69.85 168.91,96.52 162.56,102.87 101.6,102.87 95.72,97 MM32K.55
  Bottom 0.406: E3.12 E3A.12
D10
  Top 0.406: E3A.13 170.18,69.85 170.18,96.52 162.56,104.14 101.6,104.14 95.08,97.61 MM32K.56
  Bottom 0.406: E3.13 E3A.13
D11
  Top 0.406: E3.15 162.56,76.2 121.92,76.2 115.98,82.14 MM32K.34
  Bottom 0.406: E3.15 E3A.15
DEL1
  Top 0.406: MM32K.87 68.24,88.64 66.94,87.33 MMU8L.42
DEL2
  Top 0.406: MM32K.86 67.69,89.28 66.39,87.98 MMU8L.43
DEL3
  Top 0.406: MM32K.85 66.91,89.94 65.61,88.64 MMU8L.44
DEL4
  Top 0.406: MM32K.83 66.91,91.23 65.61,89.94 MMU8L.46
DEL5
  Top 0.406: MM32K.82 66.48,91.89 65.19,90.58 MMU8L.47
DEL6
  Top 0.406: MM32K.81 65.86,92.53 64.56,91.23 MMU8L.48
E_OR_F_SET  (via drill 0.81)
  Top 0.406: v45.72,40.64 45.72,41.91 41.67,45.95 MMU8L.21
  Bottom 0.406: CPU2P.17 46.99,34.29 49.53,34.29 49.53,39.37 48.26,40.64 v45.72,40.64
EA0  (via drill 0.81)
  Top 0.406: E4A.10 153.67,86.36 v121.92,86.36 120.3,87.98 MM32K.43 | v71.12,78.74 69.85,77.47 50.8,77.47 50.01,78.26 MMU8L.30
  Bottom 0.406: E4A.10 E4.10 154.94,76.2 156.21,74.93 156.21,63.5 E3A.10 E3.10 | v121.92,86.36 114.3,78.74 v71.12,78.74
EA1  (via drill 0.81)
  Top 0.406: E4.9 149.86,83.82 v123.19,83.82 121.92,83.82 118.41,87.33 MM32K.42 | v72.39,77.47 71.12,76.2 46.99,76.2 46.88,76.31 MMU8L.29
  Bottom 0.406: E4A.9 E4.9 152.4,76.2 153.67,74.93 153.67,63.5 E3A.9 E3.9 | v123.19,83.82 120.65,83.82 114.3,77.47 v72.39,77.47
EA2  (via drill 0.81)
  Top 0.406: E4.8 148.59,82.55 v121.92,82.55 119.08,85.39 MM32K.39 | v73.66,76.2 72.39,74.93 46.99,74.93 45.58,76.34 MMU8L.27
  Bottom 0.406: E4A.8 E4.8 149.86,76.2 151.13,74.93 151.13,63.5 E3A.8 E3.8 | v121.92,82.55 115.57,76.2 v73.66,76.2
EMA  (via drill 0.81)
  Top 0.406: v78.74,41.91 78.74,46.99 83.38,51.62 83.38,53.34 v82.55,53.34 | MMU8L.39 53.63,85.39 54.61,86.36 59.69,86.36 v60.96,85.09 61.97,84.08 MM32K.94
  Bottom 0.406: MEM2P.3 77.47,34.29 74.93,34.29 73.66,35.56 73.66,40.64 74.93,41.91 v78.74,41.91 | v82.55,53.34 81.28,54.61 67.31,54.61 59.69,62.23 59.69,83.82 v60.96,85.09
FIELD1  (via drill 0.81)
  Top 0.406: BMA2P.9 138.43,36.83 v138.43,45.72 | v57.15,83.82 53.34,83.82 52.3,82.78 MMU8L.35
  Bottom 0.406: v138.43,45.72 138.43,48.26 134.62,52.07 67.31,52.07 57.15,62.23 v57.15,83.82
GND  (via drill 0.81)
  Top 0.406: ACB2P.20 49.53,120.65 49.53,113.03 | 49.53,113.03 ACB1P.20 | Q1A.4 49.53,113.03 | CPU2P.2 22.54,35.24 R4.2 | PROG1.2 17.78,76.2 23.71,82.14 MMU8L.97 28.8,82.14 32.38,85.72 v32.38,87 31.39,87.98 MMU8L.88 | v36.83,81.28 36.48,80.92 MMU8L.13 | v40.64,91.44 41.02,91.83 MMU8L.61 | 100.33,38.1 104.14,41.91 FIELDS.1 | J2.S1 7.69,37.26 J2.B12 13.44,35.77 R3.2 R4.2 | J2.S2 7.61,30.19 J2.A12 | PROG1.10 R4.2 | MEM2P.2 68.58,45.72 PROG2.10 | MEM1P.20 100.33,29.21 100.33,38.1 | 100.33,38.1 MEM2P.20 | R2.2 132.08,45.4 v132.08,46.99 | R1.2 134.62,45.4 v134.62,46.99 v134.62,53.34 | BMB1P.20 100.33,113.03 100.33,120.65 BMB2P.20 105.41,121.92 | BMB1P.18 97.79,110.49 97.79,105.41 91.83,99.44 MM32K.61 91.83,91.06 v92.71,90.17 | v40.64,83.82 43.18,83.82 v45.09,81.92 46.23,80.78 MMU8L.28 | v31.75,91.44 31.27,91.92 MMU8L.76 | v46.99,88.9 47.38,89.28 MMU8L.45 | v46.99,85.09 47.94,86.03 MMU8L.40 | MM32K.88 79.09,87.98 v81.28,90.17 82.08,90.97 MM32K.76 | v81.28,82.55 80.86,82.14 MM32K.97 | v86.36,81.28 87.28,80.36 MM32K.13 | v92.71,82.55 95.25,82.55 97.03,80.78 MM32K.28 | MM32K.40 93.03,86.03 v92.71,86.36 95.25,88.9 97.79,88.9 98.17,89.28 MM32K.45 | C18.2 v124.46,92.71 | v124.46,69.85 C17.2 | 105.41,121.92 109.22,121.92 | 109.22,121.92 113.03,121.92 | 113.03,121.92 116.84,121.92 | 116.84,121.92 120.65,121.92 | 120.65,121.92 124.46,121.92 | 124.46,121.92 BAC2P.2 | R5.2 105.41,121.92 | R6.2 109.22,121.92 | R7.2 113.03,121.92 | R8.2 116.84,121.92 | R9.2 120.65,121.92 | R10.2 124.46,121.92
  Bottom 0.406: ACB1P.2 ACB1P.4 ACB1P.6 ACB1P.8 ACB1P.10 ACB1P.12 ACB1P.14 ACB1P.16 ACB1P.18 ACB1P.20 49.53,113.03 74.93,113.03 BMB1P.2 BMB1P.4 BMB1P.6 BMB1P.8 BMB1P.10 BMB1P.12 BMB1P.14 BMB1P.16 BMB1P.18 BMB1P.20 BAC1P.2 BAC1P.4 BAC1P.6 BAC1P.8 BAC1P.10 BAC1P.12 BAC1P.14 BAC1P.16 BAC1P.18 BAC1P.20 | ACB2P.2 ACB2P.4 ACB2P.6 ACB2P.8 ACB2P.10 ACB2P.12 ACB2P.14 ACB2P.16 ACB2P.18 ACB2P.20 BMB2P.2 BMB2P.4 BMB2P.6 BMB2P.8 BMB2P.10 BMB2P.12 BMB2P.14 BMB2P.16 BMB2P.18 BMB2P.20 | Q1.7 Q1A.4 | CPU2P.2 CPU2P.4 CPU2P.6 31.75,38.1 | 31.75,38.1 CPU2P.8 CPU2P.10 CPU2P.12 CPU2P.14 CPU2P.16 CPU2P.18 CPU2P.20 | DAT2P.2 DAT2P.4 DAT2P.6 DAT2P.8 DAT2P.10 DAT2P.12 DAT2P.14 DAT2P.16 DAT2P.18 DAT2P.20 50.8,17.78 | CPU1P.6 CPU1P.8 CPU1P.10 CPU1P.12 CPU1P.14 CPU1P.16 CPU1P.18 CPU1P.20 50.8,25.4 50.8,17.78 | CPU1P.6 CPU1P.4 CPU1P.2 | DAT1P.2 DAT1P.4 DAT1P.6 DAT1P.8 DAT1P.10 DAT1P.12 DAT1P.14 DAT1P.16 DAT1P.18 DAT1P.20 | DAT1P.20 50.8,10.16 50.8,17.78 | CPU1P.6 31.75,29.21 31.75,38.1 | BAC2P.2 BAC2P.4 BAC2P.6 BAC2P.8 BAC2P.10 BAC2P.12 BAC2P.14 BAC2P.16 BAC2P.18 BAC2P.20 153.67,120.65 153.67,113.03 BAC1P.20 | BMA1P.2 BMA1P.4 BMA1P.6 BMA1P.8 BMA1P.10 BMA1P.12 BMA1P.14 BMA1P.16 BMA1P.18 BMA1P.20 153.67,27.94 | BMA2P.2 BMA2P.4 133.35,38.1 | BMA2P.20 BMA2P.18 BMA2P.16 BMA2P.14 BMA2P.12 BMA2P.10 BMA2P.8 BMA2P.6 133.35,38.1 | PROG1.10 16.51,59.69 16.51,67.31 PROG1.2 | PROG2.10 69.85,59.69 69.85,67.31 PROG2.2 | C3.2 v36.83,81.28 C4.2 38.1,80.96 38.1,80.01 43.18,80.01 v45.09,81.92 46.35,81.92 46.99,82.55 v46.99,85.09 v46.99,88.9 | C1.2 32.7,86.68 v32.38,87 32.7,87.31 C8.2 | C8.2 33.34,89.54 C7.2 v31.75,91.44
  Bottom 0.406: MEM1P.2 MEM1P.4 MEM1P.6 MEM1P.8 MEM1P.10 MEM1P.12 MEM1P.14 MEM1P.16 MEM1P.18 MEM1P.20 | MEM2P.20 MEM2P.18 MEM2P.16 MEM2P.14 MEM2P.12 MEM2P.10 MEM2P.8 MEM2P.6 MEM2P.4 MEM2P.2 | FIELDS.1 FIELDS.3 FIELDS.5 FIELDS.7 FIELDS.9 FIELDS.11 FIELDS.13 FIELDS.15 124.46,53.34 | J2.S2 J2.S4 J2.S3 J2.S1 | 153.67,17.78 153.67,8.89 DAD1P.20 DAD1P.18 DAD1P.16 DAD1P.14 DAD1P.12 DAD1P.10 DAD1P.8 DAD1P.6 DAD1P.4 DAD1P.2 PANEL.20 PANEL.18 PANEL.16 PANEL.14 PANEL.12 PANEL.10 PANEL.8 PANEL.6 PANEL.4 PANEL.2 DAT1P.20 | 153.67,17.78 153.67,27.94 | 153.67,27.94 153.67,36.83 BMA2P.20 | BMA2P.20 165.1,50.8 E3.14 E3A.14 166.37,63.5 166.37,80.01 E4.14 E4A.14 166.37,86.36 166.37,97.79 BAC1P.20 | 153.67,17.78 DAD2P.20 DAD2P.18 DAD2P.16 DAD2P.14 DAD2P.12 DAD2P.10 DAD2P.8 DAD2P.6 DAD2P.4 DAD2P.2 50.8,17.78 | v134.62,46.99 133.35,46.99 | 133.35,46.99 v132.08,46.99 | 133.35,46.99 133.35,38.1 | v40.64,83.82 C5.2 C2.2 C6.2 v40.64,91.44 38.1,88.9 C8.2 | C11.2 C9.2 C16.2 C15.2 v81.28,90.17 | C11.2 81.6,82.55 v81.28,82.55 | C11.2 82.87,80.96 83.82,80.01 86.36,80.01 v86.36,81.28 C12.2 87.95,81.6 88.9,82.55 v92.71,82.55 C13.2 C10.2 | C10.2 C14.2 v92.71,90.17 | C10.2 v92.71,86.36 | v124.46,92.71 v124.46,69.85 124.46,53.34 | v134.62,53.34 124.46,53.34
  pour Bottom: 0,0 177.8,0 177.8,127 0,127
  pour Top: 0,0 177.8,0 177.8,127 0,127
INIT  (via drill 0.81)
  Top 0.406: v15.24,87.63 16.84,86.03 MMU8L.91 | DAD2P.1 130.81,13.97 153.67,13.97 158.75,19.05 158.75,44.45 171.45,57.15 171.45,97.79 151.13,118.11 151.13,120.65 130.81,120.65 BAC2P.1 | v127,118.11 125.88,119.23 R10.1
  Bottom 0.406: BAC2P.1 128.27,118.11 v127,118.11 25.4,118.11 15.24,107.95 v15.24,87.63
IOP1  (via drill 0.81)
  Top 0.406: v19.05,83.82 20.61,85.39 MMU8L.92 | R5.1 v105.41,114.3
  Bottom 0.406: BAC2P.11 137.16,114.3 v105.41,114.3 25.4,114.3 19.05,107.95 v19.05,83.82
IOP2  (via drill 0.81)
  Top 0.406: v17.78,90.17 19.32,88.64 MMU8L.87 | R6.1 v109.22,115.57
  Bottom 0.406: BAC2P.9 135.89,115.57 v109.22,115.57 25.4,115.57 17.78,107.95 v17.78,90.17
IOP4  (via drill 0.81)
  Top 0.406: v16.51,88.9 18.07,87.33 MMU8L.89 | R7.1 v113.03,116.84
  Bottom 0.406: BAC2P.7 134.62,116.84 v113.03,116.84 25.4,116.84 16.51,107.95 v16.51,88.9
JMP_OR_JMS  (via drill 0.81)
  Top 0.406: v43.18,40.64 43.18,41.91 39.73,45.37 MMU8L.18
  Bottom 0.406: CPU2P.15 45.72,33.02 49.53,33.02 50.8,34.29 50.8,39.37 48.26,41.91 44.45,41.91 v43.18,40.64
MB00  (via drill 0.81)
  Top 0.406: BMB1P.17 v96.52,106.68 96.52,105.41 95.25,104.14 88.58,97.44 MM32K.66 | v64.77,93.98 62.67,91.89 MMU8L.49
  Bottom 0.406: v96.52,106.68 96.52,105.41 86.36,95.25 68.58,95.25 67.31,93.98 v64.77,93.98
MB01  (via drill 0.81)
  Top 0.406: BMB1P.15 v93.98,104.78 87.92,98.67 MM32K.67 | v62.23,95.25 59.52,92.53 MMU8L.50
  Bottom 0.406: v93.98,104.78 85.72,96.52 68.58,96.52 67.31,95.25 v62.23,95.25
MB02  (via drill 0.81)
  Top 0.406: BMB1P.13 v91.44,104.14 86.62,99.3 MM32K.69 | v64.77,97.79 62.23,97.79 58.9,94.46 MMU8L.51
  Bottom 0.406: v91.44,104.14 85.09,97.79 v64.77,97.79
MB03  (via drill 0.81)
  Top 0.406: BMB1P.9 v86.36,106.05 84.67,104.36 MM32K.72 | v60.96,101.6 57.15,101.6 55.88,100.33 48.26,100.33 44.27,96.34 MMU8L.56
  Bottom 0.406: v86.36,106.05 86.36,105.41 82.55,101.6 v60.96,101.6
MB04  (via drill 0.81)
  Top 0.406: BMB1P.5 v81.28,105.41 81.42,105.27 MM32K.77 | v54.61,105.41 53.34,104.14 48.26,104.14 42.33,98.2 MMU8L.59
  Bottom 0.406: v81.28,105.41 74.93,105.41 73.66,106.68 55.88,106.68 v54.61,105.41
MB05  (via drill 0.81)
  Top 0.406: BMB1P.1 76.2,104.11 79.47,100.83 MM32K.80 | v50.8,109.22 49.53,107.95 48.26,107.95 39.73,99.42 MMU8L.63
  Bottom 0.406: BMB1P.1 74.93,110.49 52.07,110.49 v50.8,109.22
MB06  (via drill 0.81)
  Top 0.406: BMB2P.15 90.17,115.57 v90.17,105.41 85.97,101.19 MM32K.70 | v63.5,99.06 57.15,99.06 55.88,97.79 48.26,97.79 46.88,96.41 MMU8L.52
  Bottom 0.406: v90.17,105.41 83.82,99.06 v63.5,99.06
MB07  (via drill 0.81)
  Top 0.406: BMB2P.11 87.63,118.11 v87.63,104.78 85.33,102.45 MM32K.71 | v62.23,100.33 57.15,100.33 55.88,99.06 48.26,99.06 44.92,95.72 MMU8L.55
  Bottom 0.406: v62.23,100.33 83.17,100.33 v87.63,104.78
MB08  (via drill 0.81)
  Top 0.406: BMB2P.7 85.09,118.11 v85.09,107.31 84.03,106.25 MM32K.73 | v59.69,102.87 57.15,102.87 55.88,101.6 48.26,101.6 43.62,96.97 MMU8L.57
  Bottom 0.406: v85.09,107.31 83.82,106.05 83.82,104.14 82.55,102.87 v59.69,102.87
MB09  (via drill 0.81)
  Top 0.406: BMB2P.5 82.55,118.11 v82.55,106.68 83.38,105.86 MM32K.74 | v55.88,104.14 54.61,102.87 48.26,102.87 42.98,97.58 MMU8L.58
  Bottom 0.406: v82.55,106.68 82.55,104.14 74.93,104.14 73.66,105.41 57.15,105.41 v55.88,104.14
MB10  (via drill 0.81)
  Top 0.406: BMB2P.3 80.01,118.11 v80.01,106.68 80.01,104.76 80.78,104 MM32K.78 | v53.34,106.68 52.07,105.41 48.26,105.41 41.67,98.83 MMU8L.60
  Bottom 0.406: v80.01,106.68 74.93,106.68 73.66,107.95 54.61,107.95 v53.34,106.68
MB11  (via drill 0.81)
  Top 0.406: BMB2P.1 77.47,118.11 v77.47,107.95 77.47,105.38 80.12,102.72 MM32K.79 | v52.07,107.95 50.8,106.68 48.26,106.68 40.38,98.8 MMU8L.62
  Bottom 0.406: v77.47,107.95 74.93,107.95 73.66,109.22 53.34,109.22 v52.07,107.95
MBODD_P  (via drill 0.81)
  Top 0.406: v86.36,45.72 86.36,46.99 85.97,47.38 MM32K.11
  Bottom 0.406: MEM2P.9 91.44,30.48 100.33,30.48 105.41,35.56 105.41,40.64 100.33,45.72 v86.36,45.72
MEM00
  Top 0.406: MEM1P.15 95.25,26.67 95.25,46.99 92.47,49.77 MM32K.21
MEM01
  Top 0.406: MEM1P.13 92.71,26.67 92.71,46.99 91.19,48.51 91.19,65.53 90.53,66.19 MM32K.18
MEM02
  Top 0.406: MEM1P.11 90.17,26.67 90.17,46.99 88.58,48.59 MM32K.15
MEM03
  Top 0.406: MEM1P.9 87.63,26.67 87.63,46.99 86.62,47.99 MM32K.12
MEM04
  Top 0.406: MEM1P.7 85.09,26.67 85.09,46.99 85.33,47.23 MM32K.10
MEM05
  Top 0.406: MEM1P.5 82.55,26.67 82.55,46.99 84.67,49.12 MM32K.9
MEM06
  Top 0.406: MEM1P.3 80.01,26.67 80.01,46.99 84.03,51.01 MM32K.8
MEM07
  Top 0.406: MEM1P.1 77.47,26.67 77.47,46.99 81.42,50.95 MM32K.4
MEM08  (via drill 0.81)
  Top 0.406: v96.52,40.64 96.52,46.99 93.12,50.38 MM32K.22
  Bottom 0.406: MEM2P.17 97.79,36.83 100.33,36.83 100.33,40.64 v96.52,40.64
MEM09  (via drill 0.81)
  Top 0.406: v93.98,41.91 93.98,46.99 91.84,49.26 91.82,49.28 91.82,66.04 91.17,66.69 MM32K.19
  Bottom 0.406: MEM2P.15 95.25,34.29 100.33,34.29 101.6,35.56 101.6,40.64 100.33,41.91 v93.98,41.91
MEM10  (via drill 0.81)
  Top 0.406: v91.44,43.18 91.44,46.99 89.22,49.2 MM32K.16
  Bottom 0.406: MEM2P.13 93.98,33.02 100.33,33.02 102.87,35.56 102.87,40.64 100.33,43.18 v91.44,43.18
MEM11  (via drill 0.81)
  Top 0.406: v88.9,44.45 88.9,46.99 87.92,47.97 MM32K.14
  Bottom 0.406: MEM2P.11 92.71,31.75 100.33,31.75 104.14,35.56 104.14,40.64 100.33,44.45 v88.9,44.45
MEM_P
  Top 0.406: MEM1P.17 97.79,26.67 97.79,46.99 93.78,51.01 MM32K.23
MEMSTART  (via drill 0.81)
  Top 0.406: BMA2P.7 135.89,36.83 135.89,41.27 135.41,41.76 R1.1 136.21,41.91 137.16,43.18 v137.16,46.99 | MMU8L.34 52.92,82.14 53.34,82.55 v55.88,82.55 56.12,82.78 MM32K.96
  Bottom 0.406: v137.16,46.99 137.16,48.26 134.62,50.8 67.31,50.8 55.88,62.23 v55.88,82.55
N$1
  Top 0.406: R4.1 17.78,33.02 16.51,31.75 12.7,31.75 11.93,32.52 J2.B5
N$2
  Bottom 0.406: E3.17 E3A.17
N$3
  Bottom 0.406: E3A.18 E3.18
N$4
  Bottom 0.406: E3A.19 E3.19
N$5
  Top 0.406: J2.A5 13.79,33.52 R3.1
PARITY
  Top 0.406: E3.16 161.29,74.93 121.92,74.93 115.36,81.48 MM32K.33
  Bottom 0.406: E3A.16 E3.16
POWER_OK  (via drill 0.81)
  Top 0.406: v27.94,40.64 27.94,41.91 32.58,46.55 MMU8L.7
  Bottom 0.406: CPU2P.3 26.67,34.29 24.13,34.29 22.86,35.56 22.86,36.83 22.86,39.37 22.86,40.64 24.13,41.91 26.67,41.91 v27.94,40.64
STOP_OK  (via drill 0.81)
  Top 0.406: v30.48,40.64 30.48,41.91 33.88,45.3 MMU8L.9
  Bottom 0.406: CPU2P.5 27.94,33.02 24.13,33.02 21.59,35.56 21.59,36.83 21.59,39.37 21.59,40.64 24.13,43.18 27.94,43.18 v30.48,40.64
TCK1  (via drill 0.81)
  Top 0.406: PROG1.1 12.7,71.12 12.7,96.52 v20.32,104.14 | v38.73,91.44 39.08,91.78 MMU8L.64
  Bottom 0.406: v20.32,104.14 25.4,99.06 31.75,99.06 35.56,94.61 v38.73,91.44
TCK2  (via drill 0.81)
  Top 0.406: v80.01,86.36 87.63,86.36 89.88,88.61 MM32K.64
  Bottom 0.406: PROG2.1 67.31,69.85 67.31,82.55 71.12,86.36 v80.01,86.36
TDI1  (via drill 0.81)
  Top 0.406: PROG1.9 16.51,59.69 v26.67,59.69 | v31.1,59.6 31.93,60.42 MMU8L.6
  Bottom 0.406: v26.67,59.69 v31.1,59.6
TDI2  (via drill 0.81)
  Top 0.406: v82.55,57.15 82.72,57.33 MM32K.6
  Bottom 0.406: PROG2.9 67.31,57.15 v82.55,57.15
TDO1  (via drill 0.7, 0.81)
  Top 0.406: PROG1.3 16.51,67.31 16.51,69.85 13.97,72.39 13.97,95.25 v20.32,101.6 | v31.6,96.52 31.93,96.34 MMU8L.75
  Bottom 0.406: v20.32,101.6 25.4,96.52 v31.6,96.52
TDO2  (via drill 0.81)
  Top 0.406: v83.19,92.71 82.72,93.17 MM32K.75
  Bottom 0.406: PROG2.3 64.77,67.31 64.77,88.9 68.58,92.71 v83.19,92.71
TMS1
  Top 0.406: PROG1.5 16.51,62.23 19.05,62.23 27.94,71.12 27.94,79.38 32.38,83.82 38.1,83.82 39.08,82.84 MMU8L.17
TMS2  (via drill 0.6, 0.81)
  Top 0.406: v90.17,63.5 89.88,63.8 MM32K.17 | PROG2.5 67.31,62.23 v73.66,62.23
  Bottom 0.406: v73.66,62.23 74.93,63.5 v90.17,63.5
TP2  (via drill 0.81)
  Top 0.406: BMA2P.3 130.81,36.83 R2.1 130.49,41.91 129.54,41.91 128.27,43.18 v128.27,46.99 | MMU8L.32 52.52,80.83 v53.34,80.01 55.88,80.01 56.7,80.83 MM32K.99
  Bottom 0.406: v128.27,46.99 127,48.26 67.31,48.26 53.34,62.23 v53.34,80.01
TP3
  Top 0.406: CPU1P.11 39.37,26.67 39.37,41.91 37.12,44.16 MMU8L.14
TS1
  Top 0.406: R9.1 120.65,116.84 129.54,116.84 BAC2P.3
TS3
  Top 0.406: R8.1 116.84,115.57 130.81,115.57 BAC2P.5
VCC  (via drill 0.81)
  Top 0.356: C19.1 20.32,33.02 13.97,26.67 | C20.1 72.39,102.87 73.66,104.14
  Top 0.406: v46.99,64.77 67.31,64.77 PROG2.4 | E3A.28 C17.1 127.95,56.83 127,55.88 v106.68,38.1 | E4A.28 C18.1 | 5.7,34.29 5.7,31.75 5.95,31.5 J2.A9 9.14,31.5 13.97,26.67 22.86,17.78 22.86,15.24 25.4,12.7 99.06,12.7 v106.68,20.32 | J2.B9 5.95,34.54 5.7,34.29 | PROG1.4 16.51,64.77 13.97,64.77 5.7,56.5 5.7,34.29 | v45.72,91.44 46.23,91.94 MMU8L.53 | v45.72,86.36 46.05,86.69 MMU8L.41 | v45.72,83.82 46.1,83.44 MMU8L.36 | v41.91,81.28 41.02,80.39 MMU8L.20 | MMU8L.84 28.8,90.58 v29.21,90.17 35.56,90.17 v36.83,91.44 36.48,91.8 MMU8L.68 | v29.21,85.09 28.86,84.73 MMU8L.93 | v31.75,81.28 31.27,80.81 MMU8L.5 | v86.36,90.17 87.28,91.08 MM32K.68 | MM32K.84 79.16,90.58 v80.01,91.44 80.01,92.08 78.74,93.34 78.74,99.06 73.66,104.14 Q1.14 | MM32K.93 86,84.73 v86.36,85.09 86.36,82.55 | 86.36,82.55 85.09,82.55 82.08,79.53 MM32K.5 | MM32K.20 91.83,80.89 v91.44,81.28 90.17,82.55 86.36,82.55 | v97.79,91.44 97.03,92.2 MM32K.53 | v97.79,82.55 98.67,83.44 MM32K.36 | v97.79,87.63 98.73,86.69 MM32K.41
  Bottom 0.406: PROG1.4 19.05,64.77 31.75,64.77 | 31.75,64.77 v46.99,64.77 | E3A.28 E3.28 130.81,74.93 130.81,91.44 E4A.28 E4.28 102.87,96.52 v97.79,91.44 | C6.1 v45.72,91.44 v45.72,86.36 | v45.72,86.36 v45.72,83.82 C5.1 44.13,83.5 v41.91,81.28 C4.1 40.32,81.6 39.37,82.55 34.29,82.55 33.02,81.6 C3.1 v31.75,81.28 | C2.1 v45.72,86.36 | v29.21,90.17 29.53,90.17 C8.1 C1.1 | C1.1 v29.21,85.09 | v31.75,81.28 30.8,82.23 C1.1 | C7.1 v36.83,91.44 | C15.1 v86.36,90.17 | C15.1 85.09,90.49 85.09,91.44 v80.01,91.44 | C15.1 C16.1 C9.1 v86.36,85.09 86.36,82.87 C11.1 | C12.1 v91.44,81.28 96.2,81.28 C13.1 v97.79,82.55 v97.79,87.63 | v97.79,91.44 v97.79,87.63 | C14.1 v97.79,91.44 | C10.1 97.47,87.63 v97.79,87.63 | v31.75,81.28 31.75,64.77 | v106.68,20.32 v106.68,38.1

### Text on the board
tPlace: Posibus Termination
tNames: 7 | 6 | 5 | 4 | 3 | 2 | 1 | 0